# EasyEDA Pro project pcb.epro, schematic Schematic1_2

## Sheets
1 MCU: Board Name: v1.2release; Create Date: 2025-08-14; Page Name: MCU; Project Name: v1.2release; Schematic Name: Schematic1_2; Update Date: 2025-08-14; Add into BOM: yes; Convert to PCB: yes; Drawed: yolo; Page Size: A4; Version: V1.0
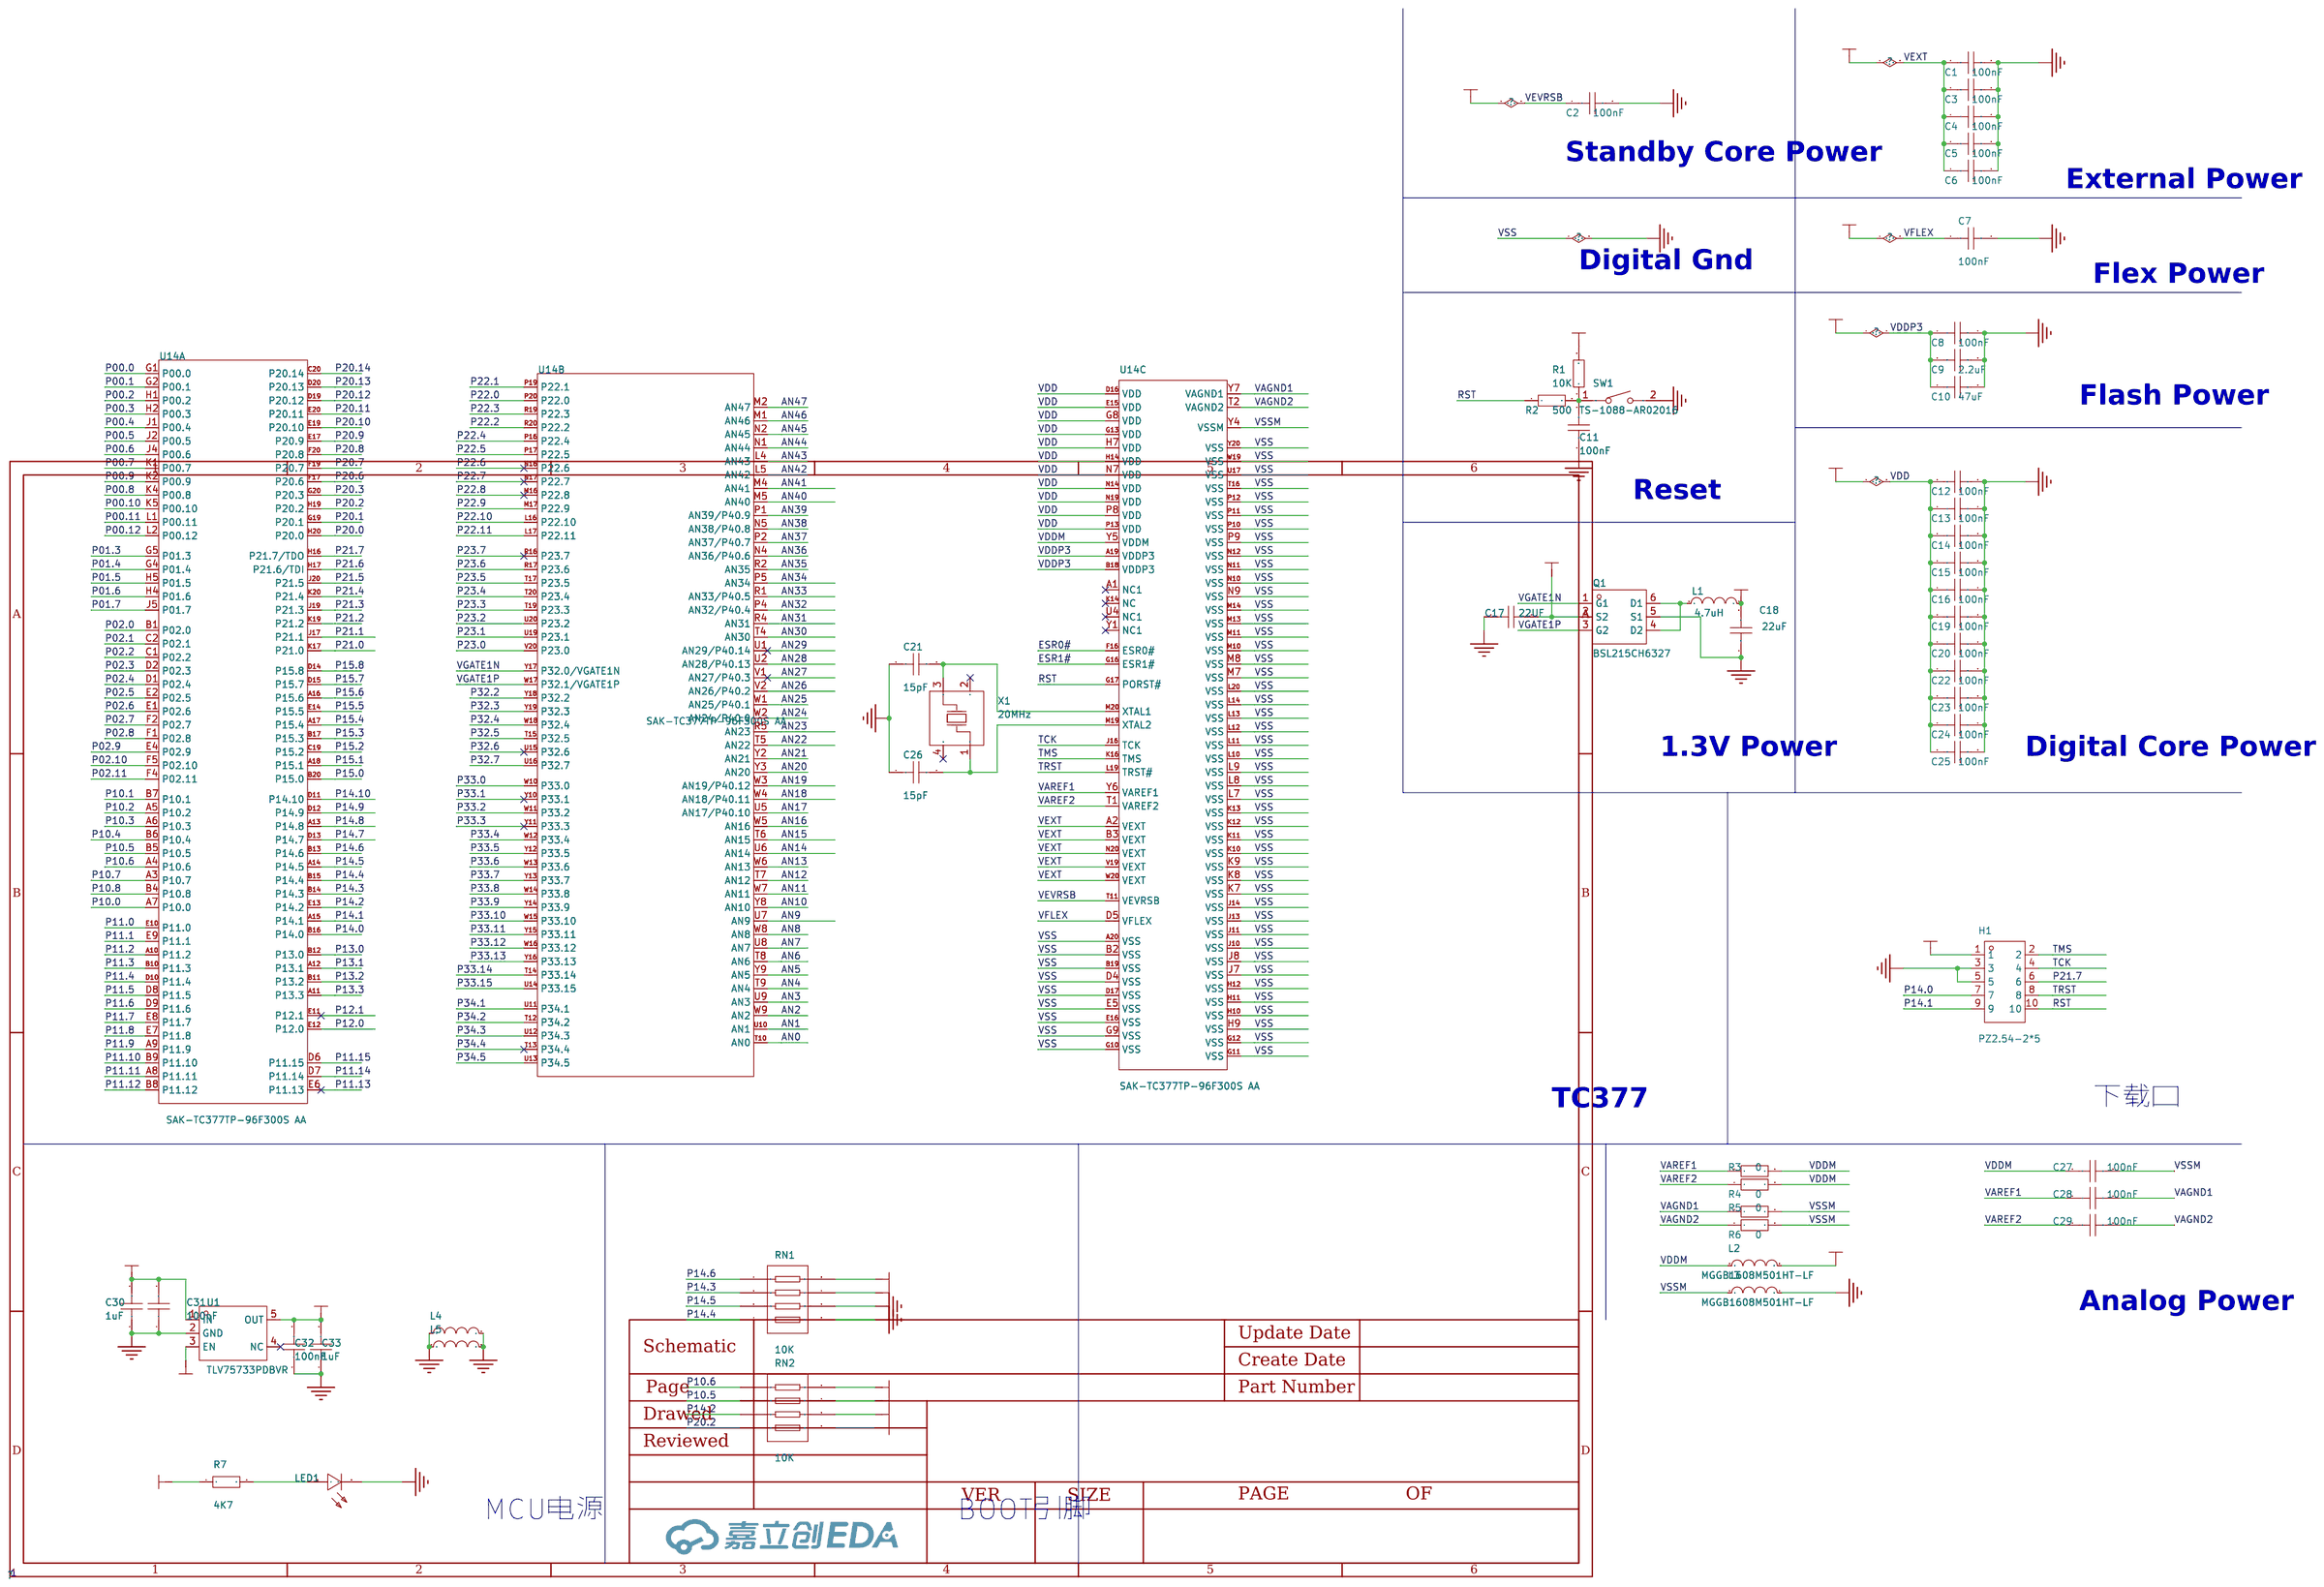
[diagram p0: MCU]
2 电源: Page Name: 电源
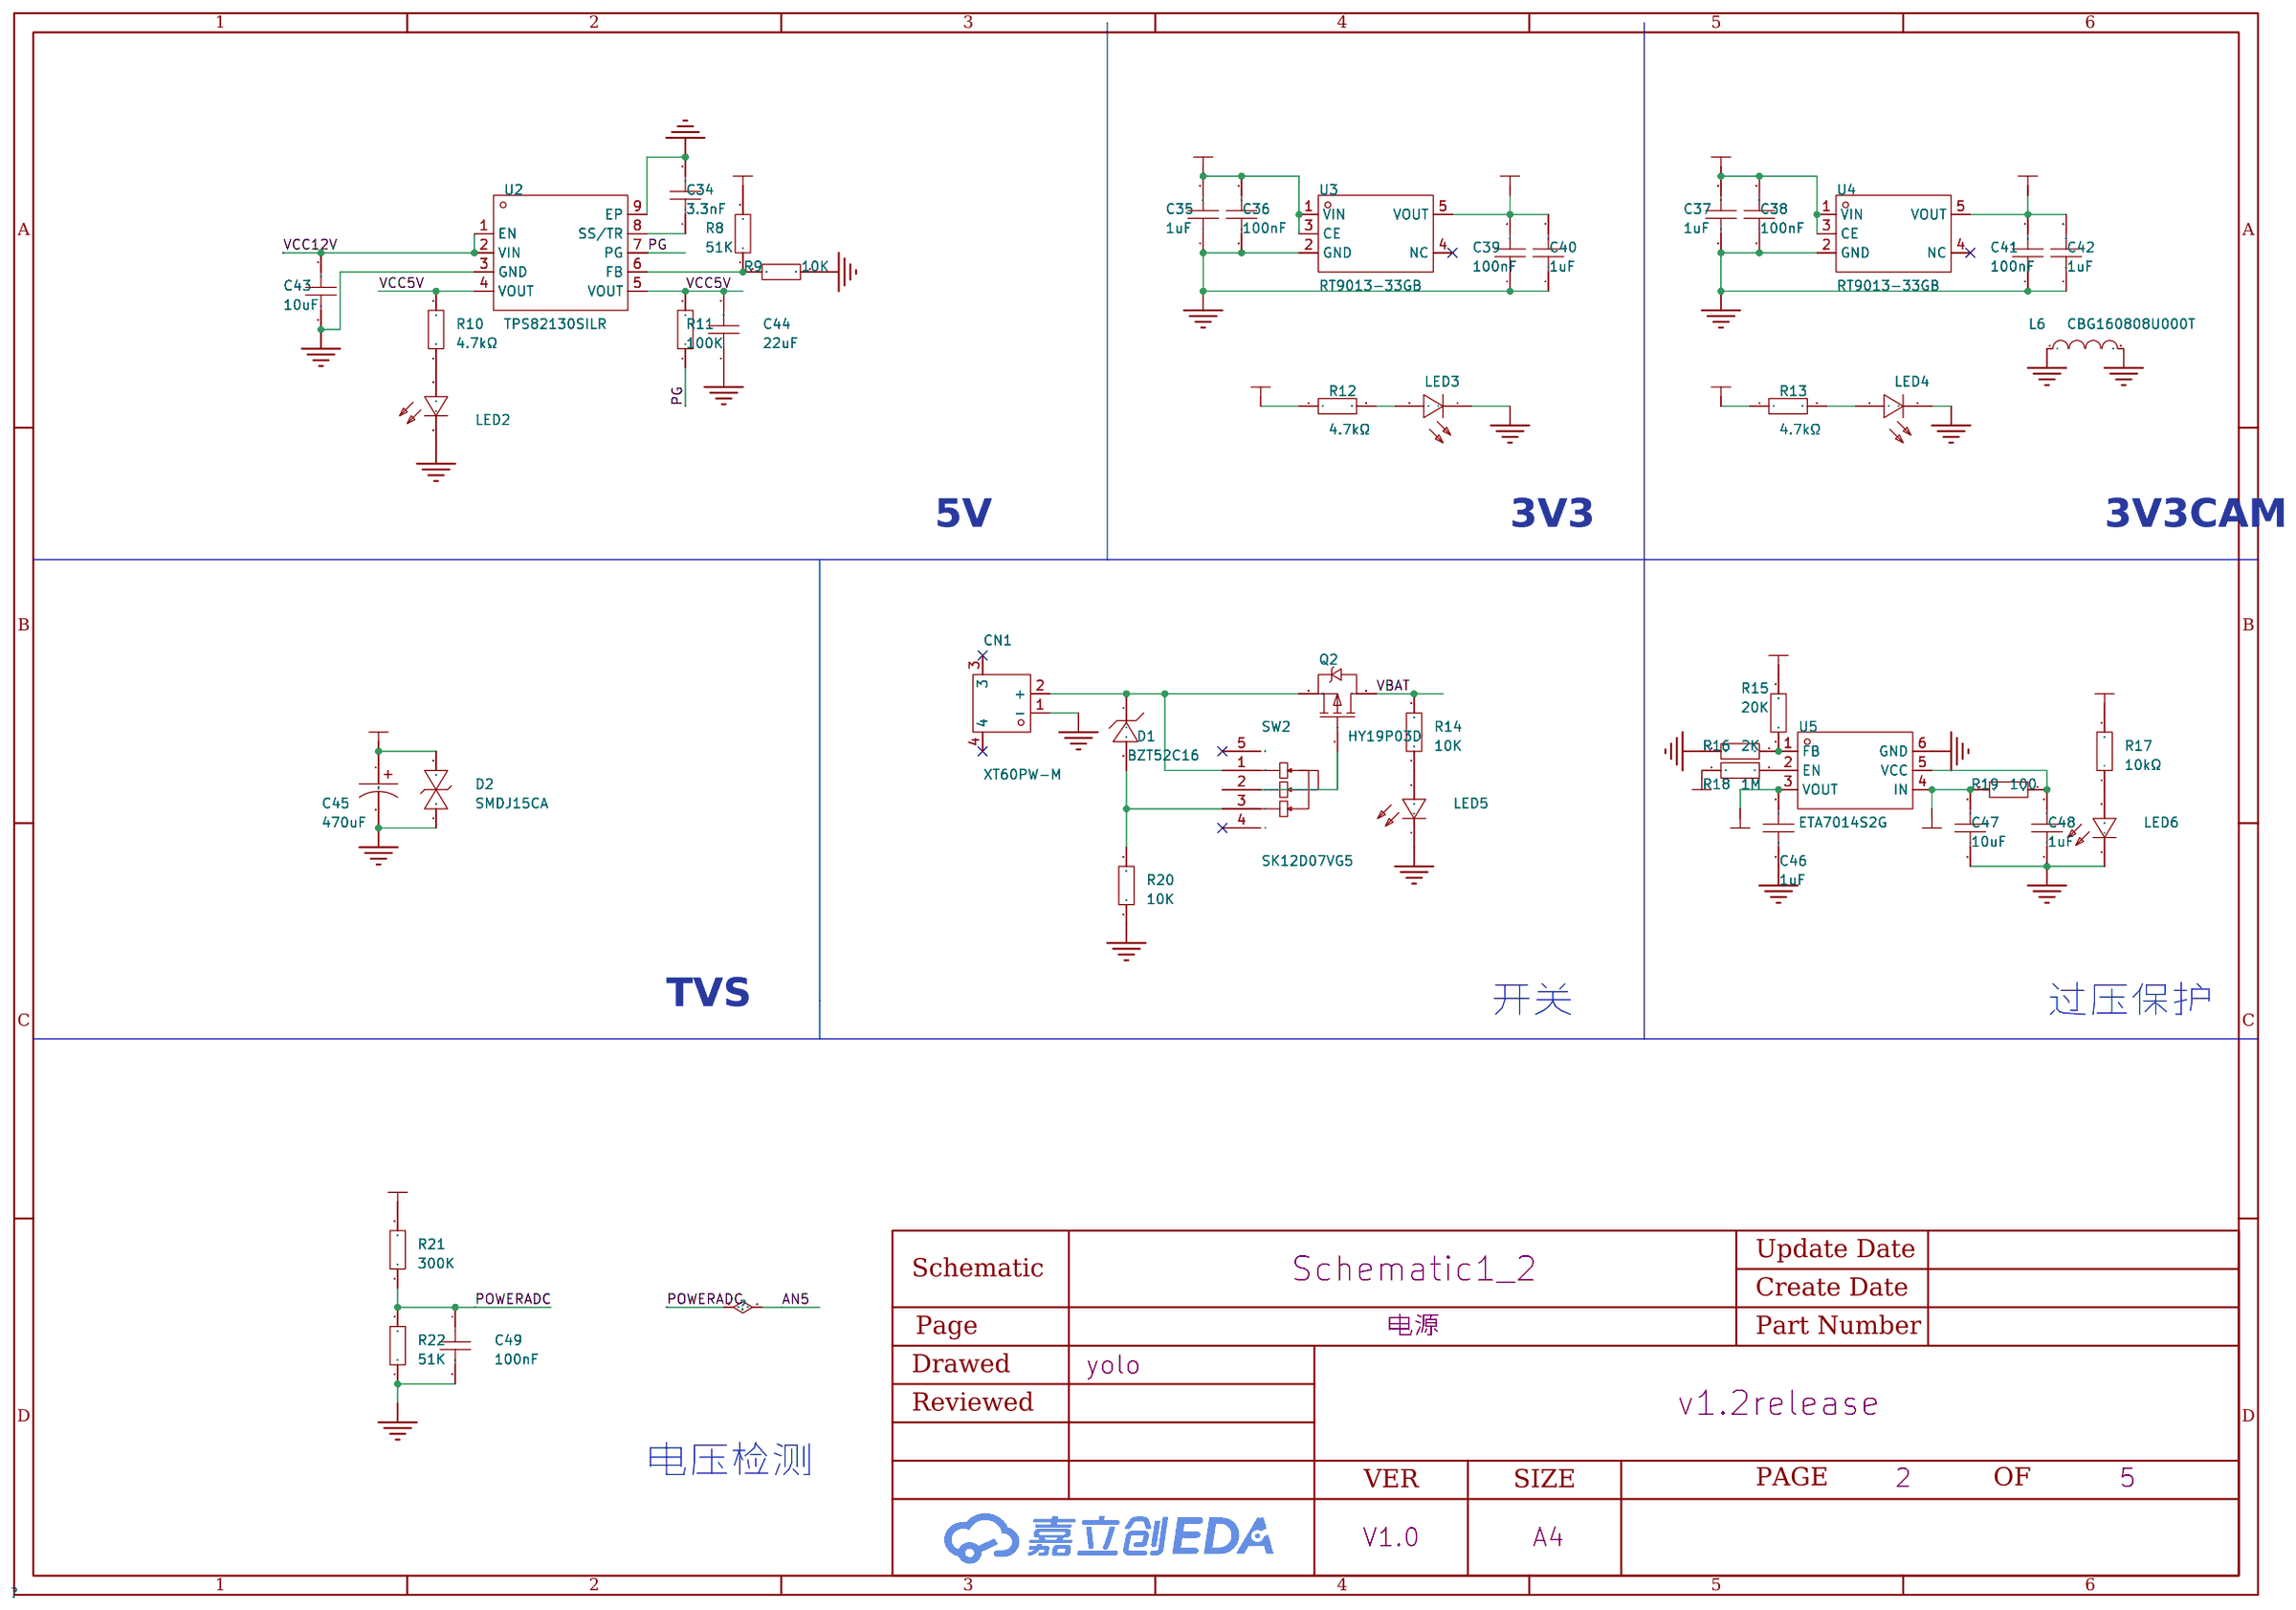
[diagram p1: 电源]
3 外设: Page Name: 外设
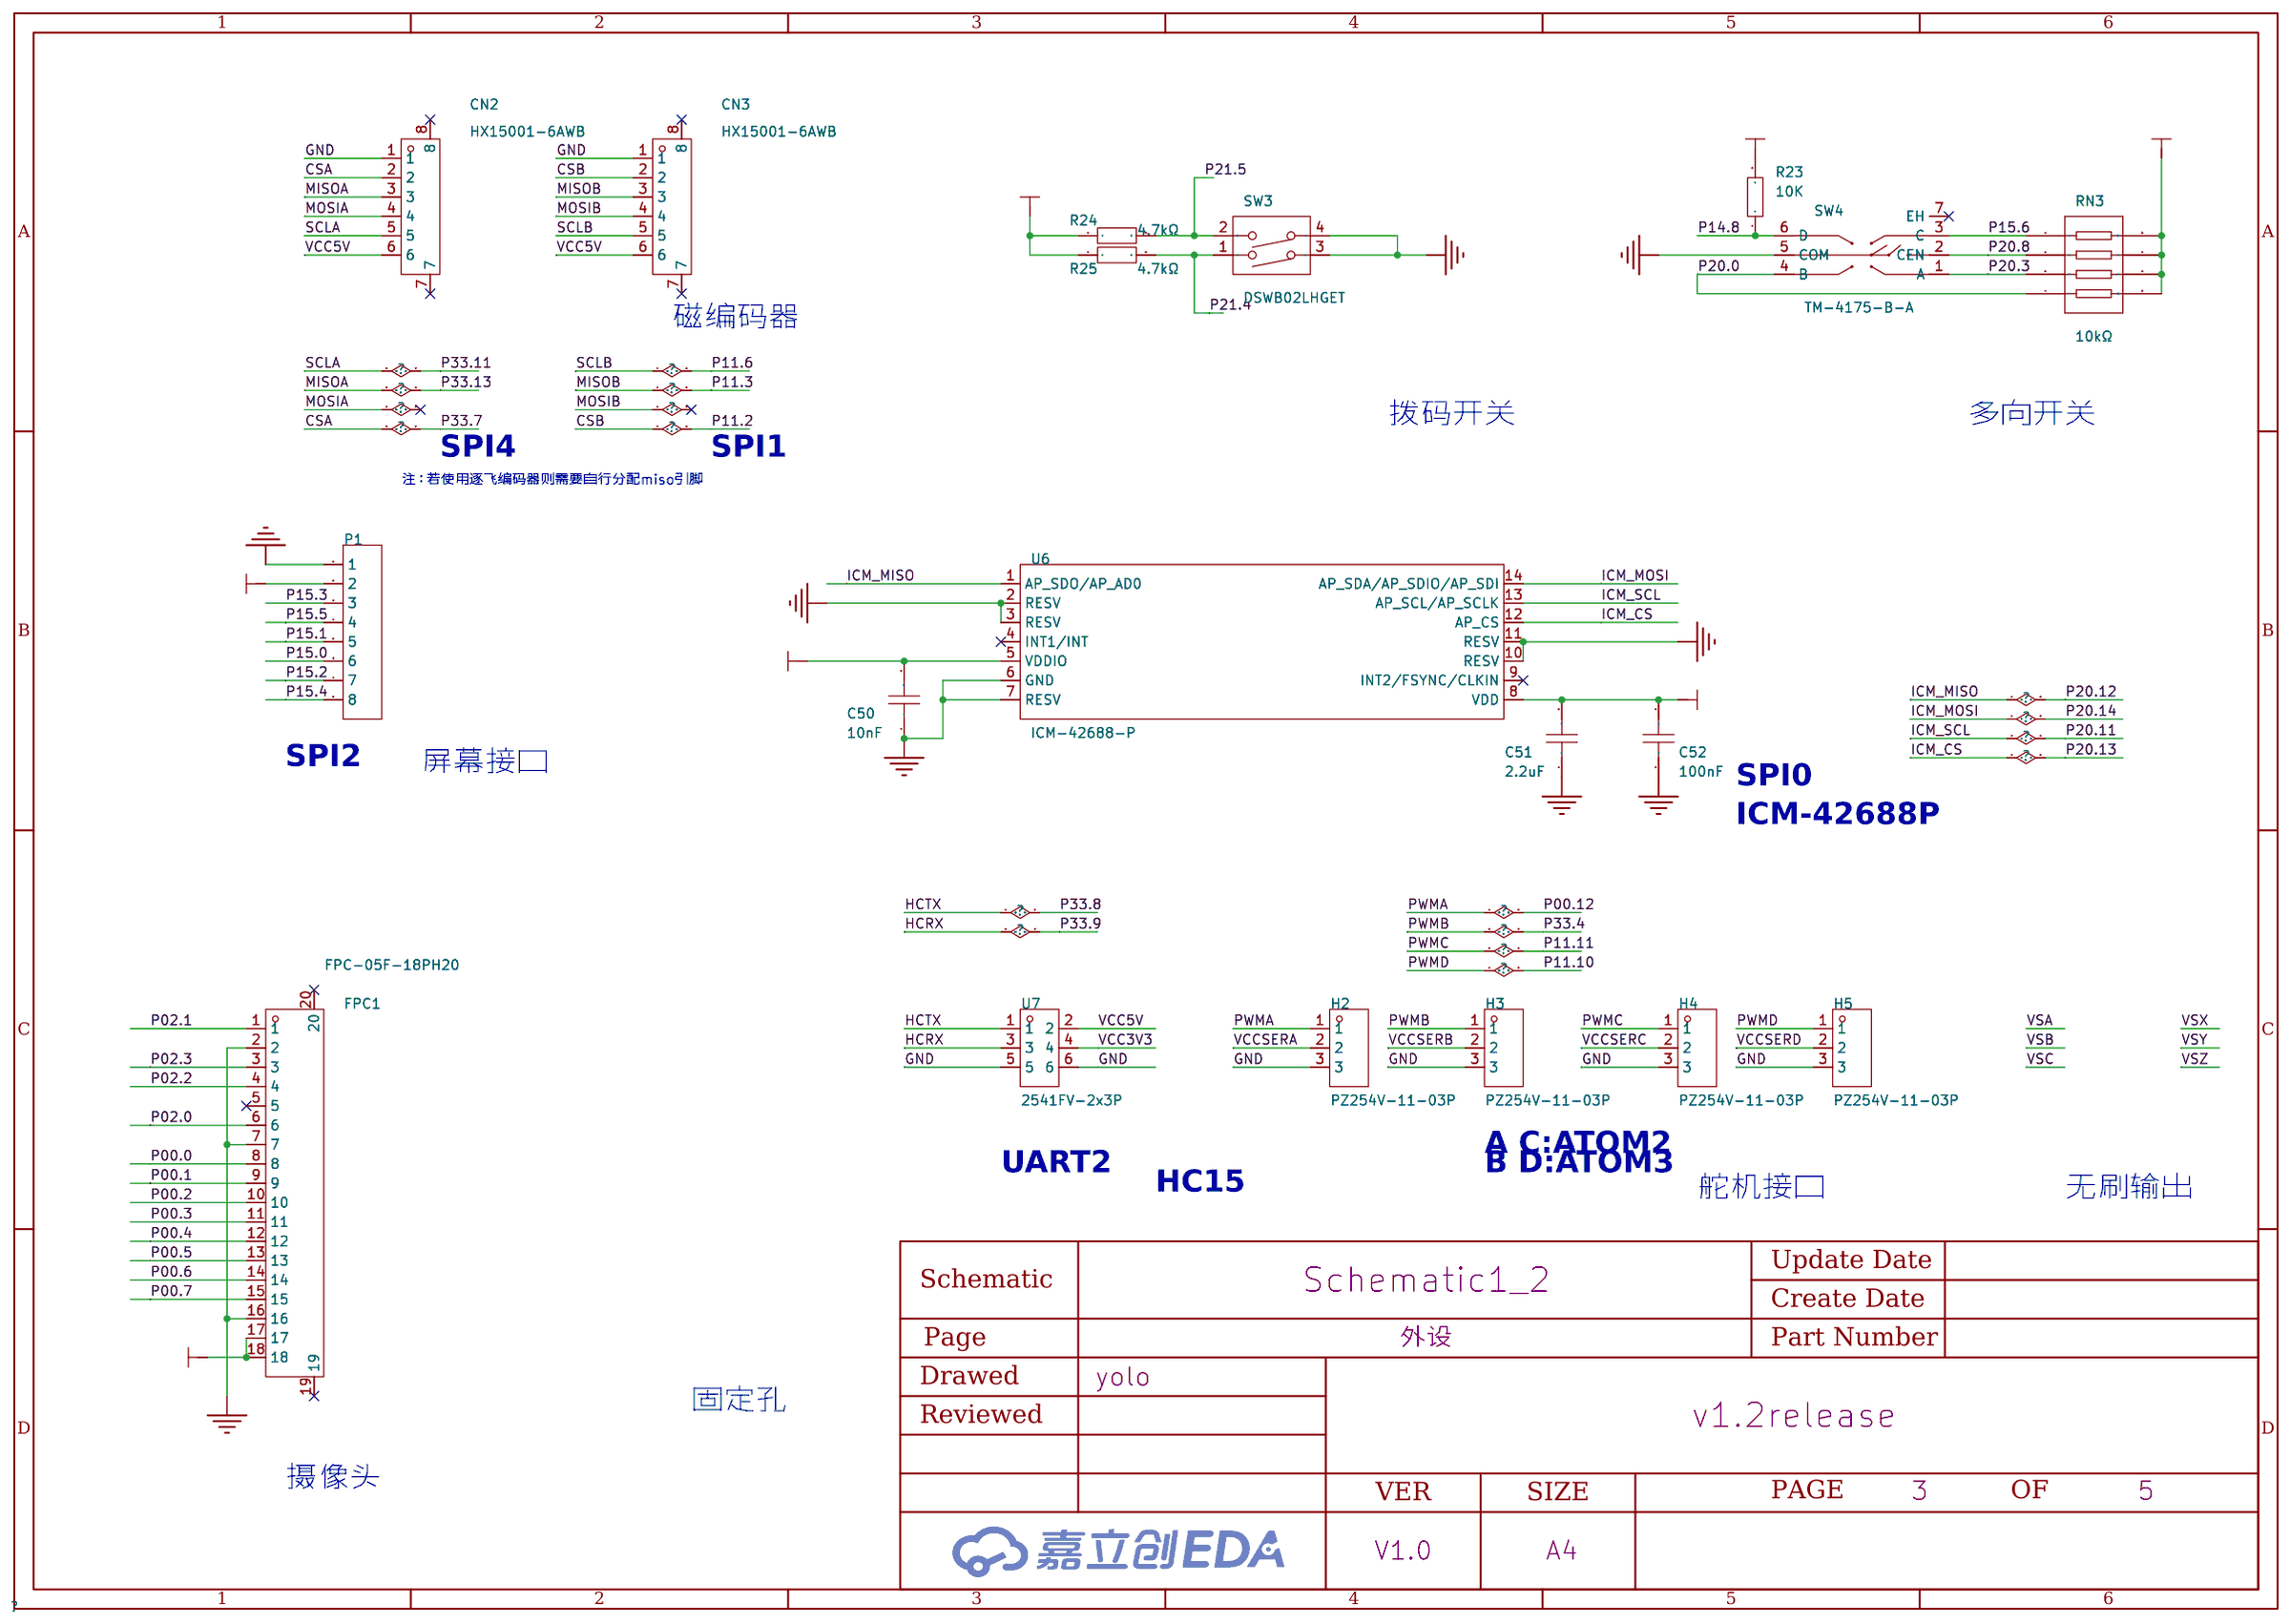
[diagram p2: 外设]
4 驱动: Page Name: 驱动
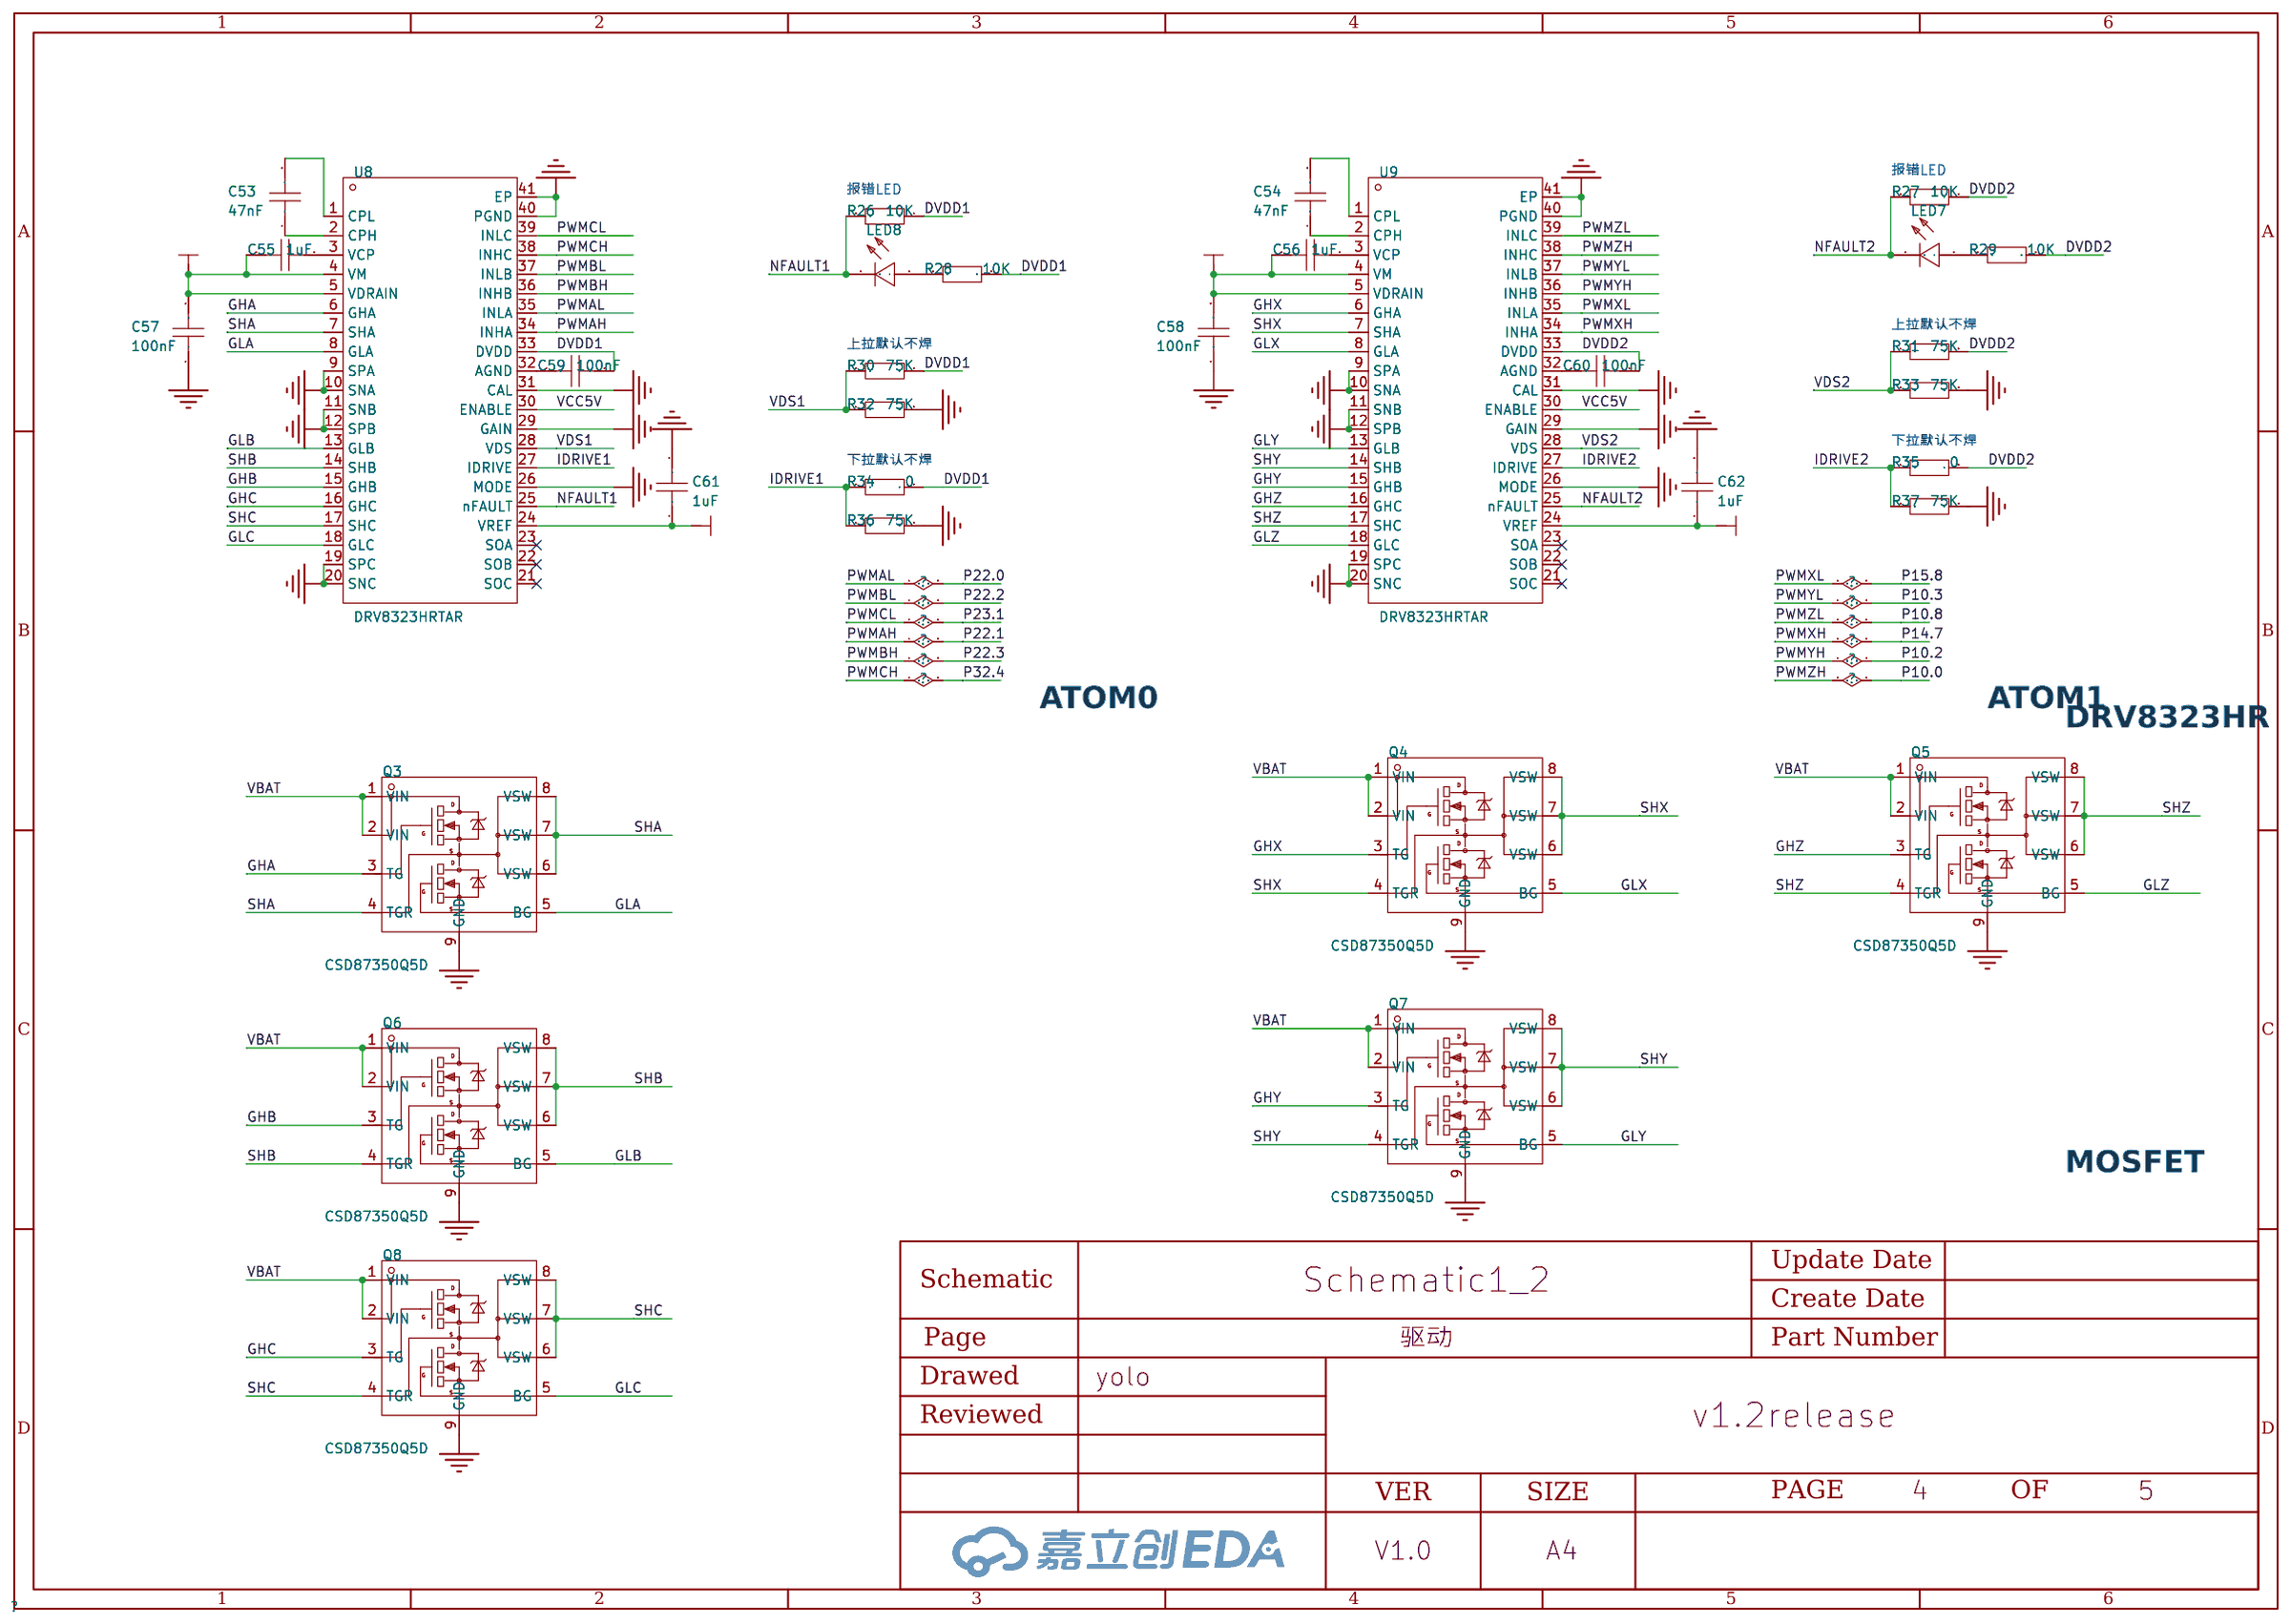
[diagram p3: 驱动]
5 舵机电源: Page Name: 舵机电源
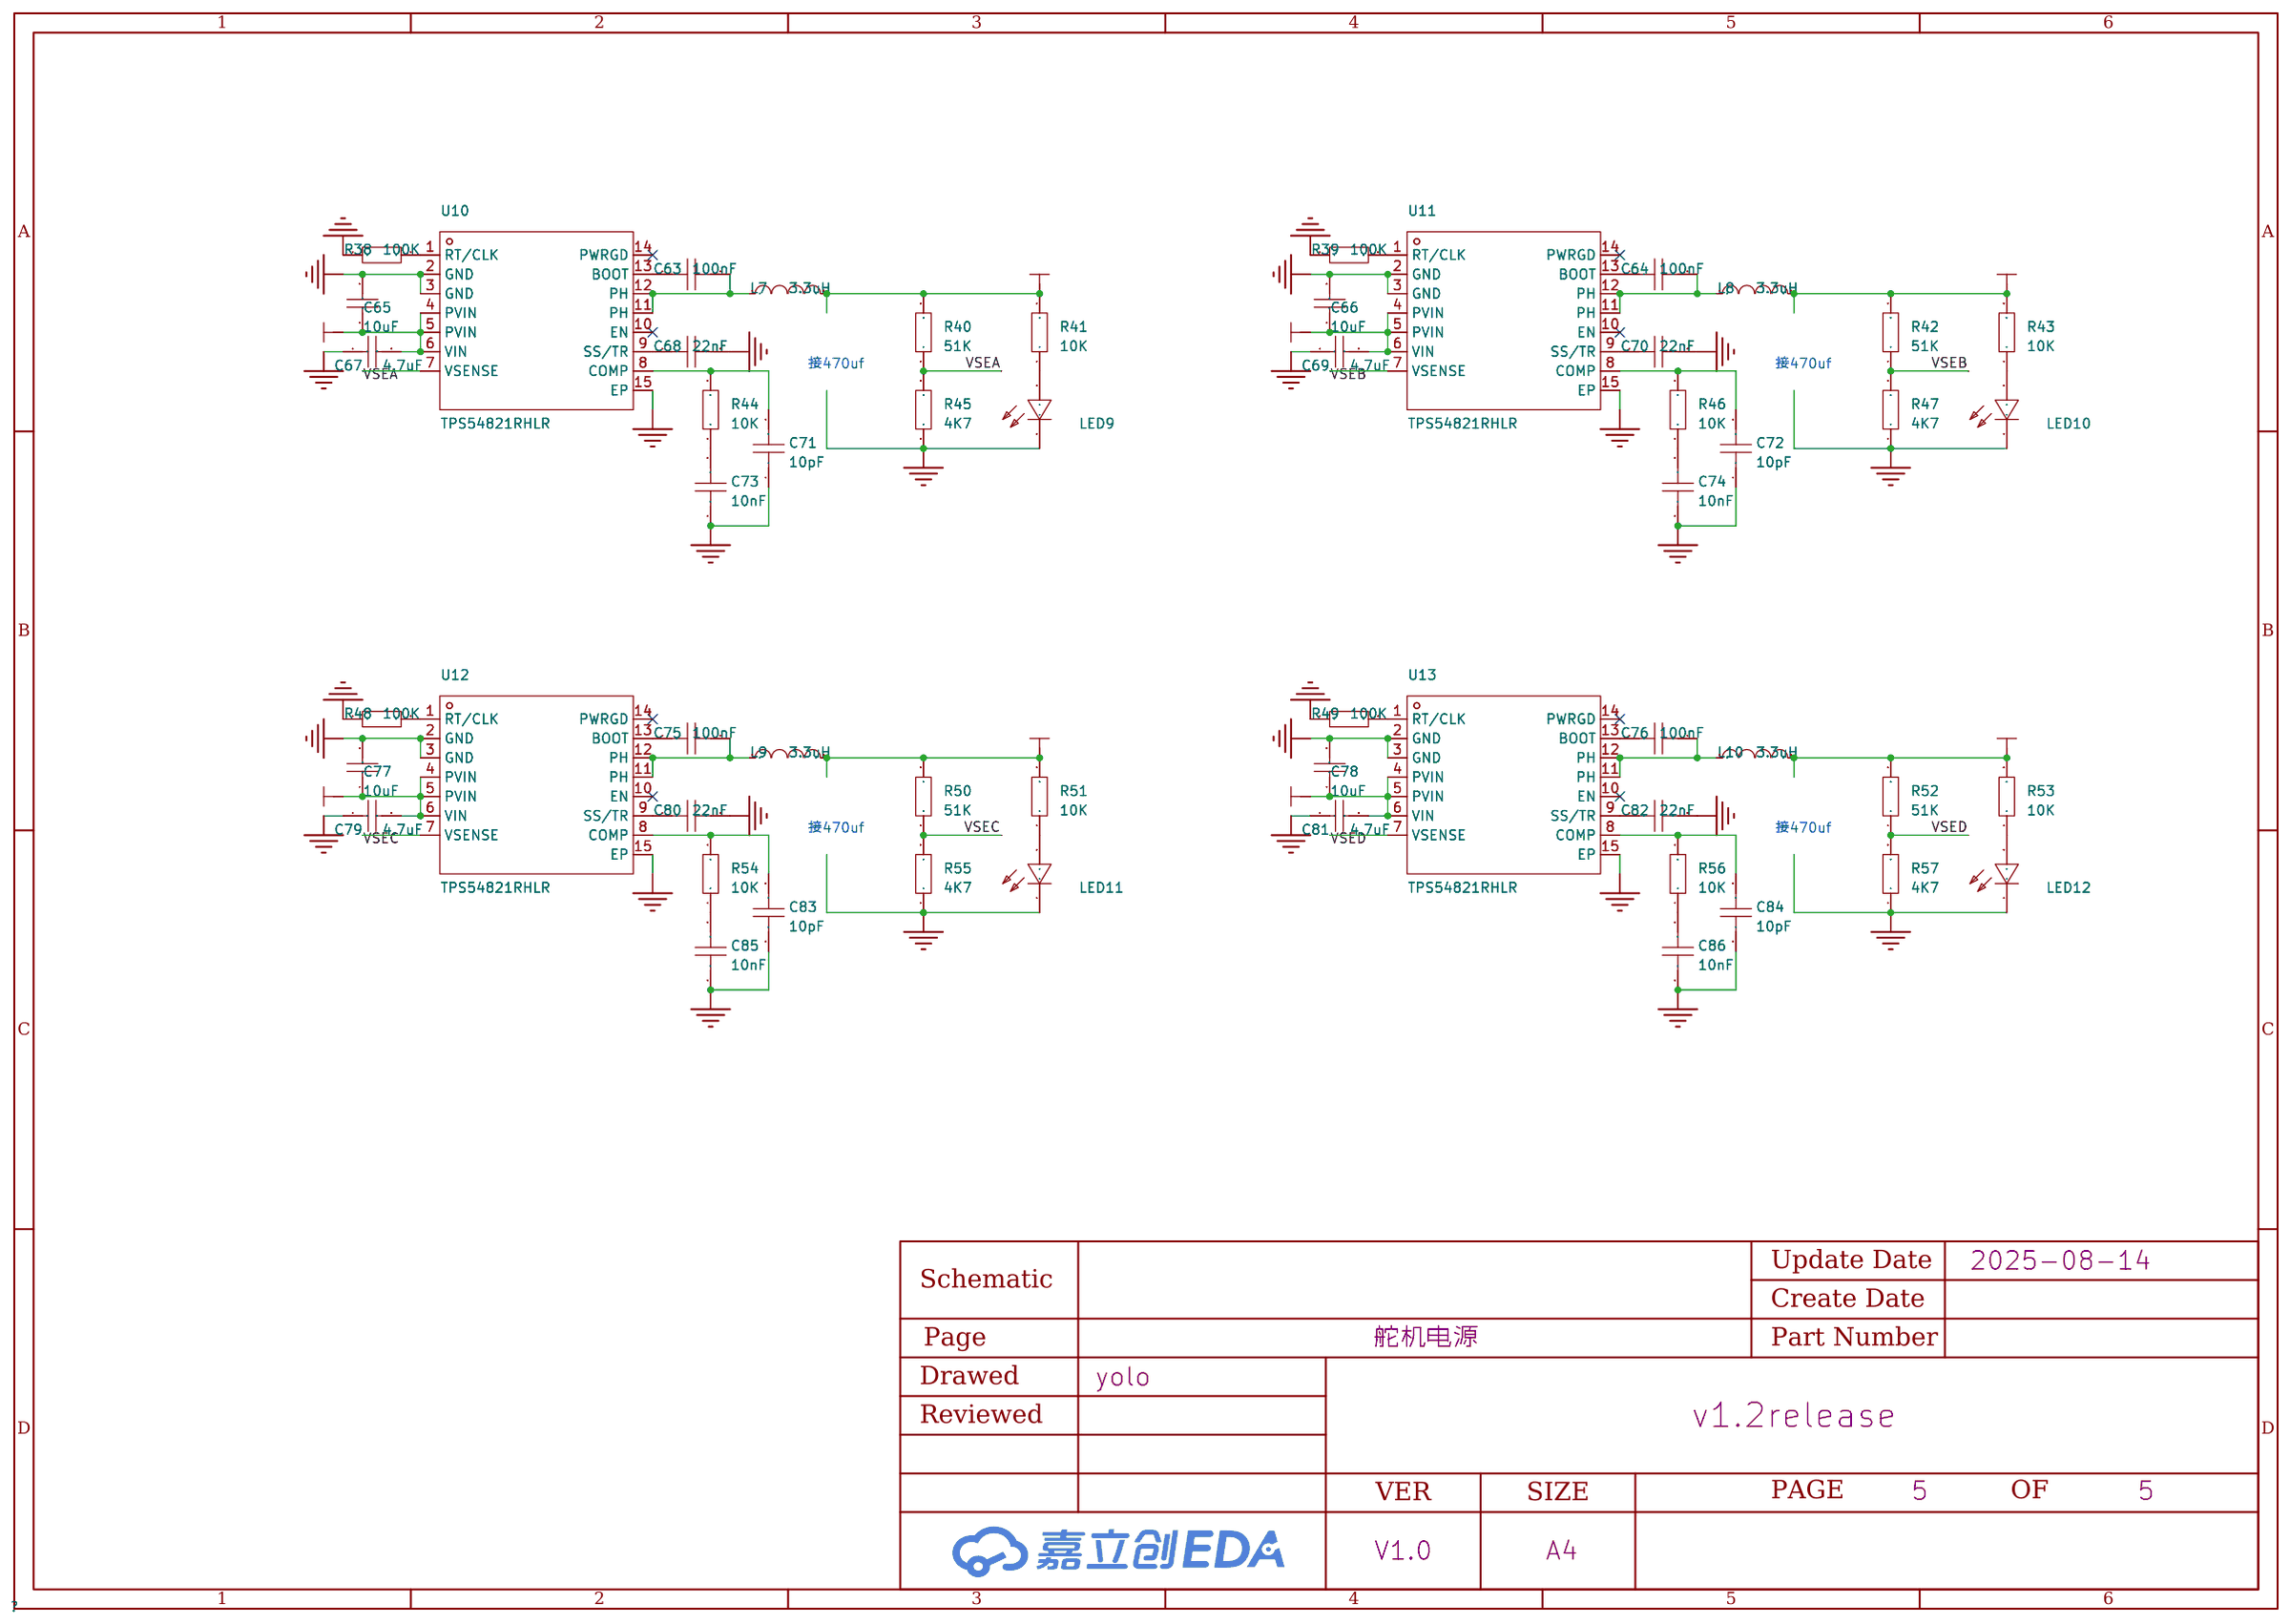
[diagram p4: 舵机电源]

## Parts
sheet MCU
C1  100nF  [C0603]
C2  100nF  [C0603]
C3  100nF  [C0603]
C4  100nF  [C0603]
C5  100nF  [C0603]
C6  100nF  [C0603]
C7  100nF  [C0603]
C8  100nF  [C0603]
C9  2.2uF  [C0603]
C10  47uF  [C0603]
C11  100nF  [C0603]
C12  100nF  [C0603]
C13  100nF  [C0603]
C14  100nF  [C0603]
C15  100nF  [C0603]
C16  100nF  [C0603]
C17  22uF  [C0603]
C18  22uF  [C0603]
C19  100nF  [C0603]
C20  100nF  [C0603]
C21  15pF  [C0603]
C22  100nF  [C0603]
C23  100nF  [C0603]
C24  100nF  [C0603]
C25  100nF  [C0603]
C26  15pF  [C0603]
C27  100nF  [C0603]
C28  100nF  [C0603]
C29  100nF  [C0603]
C30  1uF  [C0603]
C31  100nF  [C0603]
C32  100nF  [C0603]
C33  1uF  [C0603]
H1  PZ2.54-2*5  [HDR-TH_10P-P2.54-V-M-R2-C5-S2.54-1]
L1  4.7uH  [IND-SMD_L2.0-W1.6]
L2  MGGB1608M501HT-LF  [L0603]
L3  MGGB1608M501HT-LF  [L0603]
L4  CBG160808U000T  [L0603]
L5  CBG160808U000T  [L0603]
LED1  NCD0603R1  [LED0603-RD_RED]
Q1  BSL215CH6327  [TSOP-6_L3.0-W1.5-P0.95-LS2.8-BL]
R1  10K  [R0603]
R2  500  [R0603]
R3  0  [R0603]
R4  0  [R0603]
R5  0  [R0603]
R6  0  [R0603]
R7  4K7  [R0603]
RN1  10K  [RES-ARRAY-SMD_0603-8P-L3.2-W1.6-BL]
RN2  10K  [RES-ARRAY-SMD_0603-8P-L3.2-W1.6-BL]
SW1  TS-1088-AR02016  [SW-SMD_L3.9-W3.0-P4.45]
U1  TLV75733PDBVR  [SOT-23-5_L2.9-W1.6-P0.95-LS2.8-BL]
U14  SAK-TC377TP-96F300S AA  [PG-LFBGA-292_L17.0-W17.0-BL_SAK-TC1791F]  (sections 1,2,3)
X1  20MHz  [OSC-SMD_4P-L3.2-W2.5-BL]
sheet 外设
C50  10nF  [C0603]
C51  2.2uF  [C0603]
C52  100nF  [C0603]
CN2  HX15001-6AWB  [CONN-SMD_HX15001-6AWB]
CN3  HX15001-6AWB  [CONN-SMD_HX15001-6AWB]
FPC1  FPC-05F-18PH20  [FPC-SMD_18P-P0.50_FPC-05F-18PH20]
H2  PZ254V-11-03P  [HDR-TH_3P-P2.54-V-M]
H3  PZ254V-11-03P  [HDR-TH_3P-P2.54-V-M]
H4  PZ254V-11-03P  [HDR-TH_3P-P2.54-V-M]
H5  PZ254V-11-03P  [HDR-TH_3P-P2.54-V-M]
P1  2.54-1*8P母环保  [HDR-TH_8P-P2.54-V-F-1]
R23  10K  [R0603]
R24  4.7kΩ  [R0603]
R25  4.7kΩ  [R0603]
RN3  10kΩ  [RES-ARRAY-SMD_0603-8P-L3.2-W1.6-BL]
SW3  DSWB02LHGET  [SW-TH_DSWB02LHGET]
SW4  TM-4175-B-A  [SW-SMD_TM-4175-B-X]
U6  ICM-42688-P  [LGA-14_L3.0-W2.5-P0.50-TL]
U7  2541FV-2x3P  [HDR-TH_6P-P2.54-V-F-R2-C3-S2.54]
sheet 电源
C34  3.3nF  [C0603]
C35  1uF  [C0603]
C36  100nF  [C0603]
C37  1uF  [C0603]
C38  100nF  [C0603]
C39  100nF  [C0603]
C40  1uF  [C0603]
C41  100nF  [C0603]
C42  1uF  [C0603]
C43  10uF  [C0603]
C44  22uF  [C0603]
C45  470uF  [CAP-SMD_BD10.0-L10.3-W10.3-LS11.3-FD]
C46  1uF  [C0603]
C47  10uF  [C0603]
C48  1uF  [C0603]
C49  100nF  [C0603]
CN1  XT60PW-M  [CONN-TH_XT60PW-M]
D1  BZT52C16  [SOD-123_L2.7-W1.6-LS3.7-RD]
D2  SMDJ15CA  [SMC_L6.9-W5.9-LS7.9-BI]
L6  CBG160808U000T  [L0603]
LED2  NCD0603R1  [LED0603-RD_RED]
LED3  NCD0603R1  [LED0603-RD_RED]
LED4  NCD0603R1  [LED0603-RD_RED]
LED5  NCD0603R1  [LED0603-RD_RED]
LED6  NCD0603R1  [LED0603-RD_RED]
Q2  HY19P03D  [TO-252-2_L6.6-W6.1-P4.57-LS9.9-TL-CW]
R8  51K  [R0603]
R9  10K  [R0603]
R10  4.7kΩ  [R0603]
R11  100K  [R0603]
R12  4.7kΩ  [R0603]
R13  4.7kΩ  [R0603]
R14  10K  [R0603]
R15  20K  [R0603]
R16  2K  [R0603]
R17  10kΩ  [R0603]
R18  1M  [R0603]
R19  100  [R0603]
R20  10K  [R0603]
R21  300K  [R0603]
R22  51K  [R0603]
SW2  SK12D07VG5  [SW-TH_SK12D07VG5]
U2  TPS82130SILR  [USIP-8_L3.0-W2.8-P0.65-TL-EP]
U3  RT9013-33GB  [SOT-23-5_L2.9-W1.6-P0.95-LS2.8-BR]
U4  RT9013-33GB  [SOT-23-5_L2.9-W1.6-P0.95-LS2.8-BR]
U5  ETA7014S2G  [SOT-23-6_L2.9-W1.6-P0.95-LS2.8-BL]
sheet 舵机电源
C63  100nF  [C0603]
C64  100nF  [C0603]
C65  10uF  [C0805]
C66  10uF  [C0805]
C67  4.7uF  [C0805]
C68  22nF  [C0603]
C69  4.7uF  [C0805]
C70  22nF  [C0603]
C71  10pF  [C0603]
C72  10pF  [C0603]
C73  10nF  [C0603]
C74  10nF  [C0603]
C75  100nF  [C0603]
C76  100nF  [C0603]
C77  10uF  [C0805]
C78  10uF  [C0805]
C79  4.7uF  [C0805]
C80  22nF  [C0603]
C81  4.7uF  [C0805]
C82  22nF  [C0603]
C83  10pF  [C0603]
C84  10pF  [C0603]
C85  10nF  [C0603]
C86  10nF  [C0603]
L7  3.3uH  [IND-SMD_L7.1-W6.6]
L8  3.3uH  [IND-SMD_L7.1-W6.6]
L9  3.3uH  [IND-SMD_L7.1-W6.6]
L10  3.3uH  [IND-SMD_L7.1-W6.6]
LED9  NCD0603R1  [LED0603-RD_RED]
LED10  NCD0603R1  [LED0603-RD_RED]
LED11  NCD0603R1  [LED0603-RD_RED]
LED12  NCD0603R1  [LED0603-RD_RED]
R38  100K  [R0603]
R39  100K  [R0603]
R40  51K  [R0603]
R41  10K  [R0603]
R42  51K  [R0603]
R43  10K  [R0603]
R44  10K  [R0603]
R45  4K7  [R0603]
R46  10K  [R0603]
R47  4K7  [R0603]
R48  100K  [R0603]
R49  100K  [R0603]
R50  51K  [R0603]
R51  10K  [R0603]
R52  51K  [R0603]
R53  10K  [R0603]
R54  10K  [R0603]
R55  4K7  [R0603]
R56  10K  [R0603]
R57  4K7  [R0603]
U10  TPS54821RHLR  [VQFN-14_L3.5-W3.5-P0.50-TL-EP_TPS54622RHLT]
U11  TPS54821RHLR  [VQFN-14_L3.5-W3.5-P0.50-TL-EP_TPS54622RHLT]
U12  TPS54821RHLR  [VQFN-14_L3.5-W3.5-P0.50-TL-EP_TPS54622RHLT]
U13  TPS54821RHLR  [VQFN-14_L3.5-W3.5-P0.50-TL-EP_TPS54622RHLT]
sheet 驱动
C53  47nF  [C0603]
C54  47nF  [C0603]
C55  1uF  [C0603]
C56  1uF  [C0603]
C57  100nF  [C0603]
C58  100nF  [C0603]
C59  100nF  [C0603]
C60  100nF  [C0603]
C61  1uF  [C0603]
C62  1uF  [C0603]
LED7  NCD0603R1  [LED0603-RD_RED]
LED8  NCD0603R1  [LED0603-RD_RED]
Q3  CSD87350Q5D  [LSON-8_L6.0-W5.0-P1.27-LS6.0-TL-EP]
Q4  CSD87350Q5D  [LSON-8_L6.0-W5.0-P1.27-LS6.0-TL-EP]
Q5  CSD87350Q5D  [LSON-8_L6.0-W5.0-P1.27-LS6.0-TL-EP]
Q6  CSD87350Q5D  [LSON-8_L6.0-W5.0-P1.27-LS6.0-TL-EP]
Q7  CSD87350Q5D  [LSON-8_L6.0-W5.0-P1.27-LS6.0-TL-EP]
Q8  CSD87350Q5D  [LSON-8_L6.0-W5.0-P1.27-LS6.0-TL-EP]
R26  10K  [R0603]
R27  10K  [R0603]
R28  10K  [R0603]
R29  10K  [R0603]
R30  75K  [R0603]
R31  75K  [R0603]
R32  75K  [R0603]
R33  75K  [R0603]
R34  0  [R0603]
R35  0  [R0603]
R36  75K  [R0603]
R37  75K  [R0603]
U8  DRV8323HRTAR  [QFN-40_L6.0-W6.0-P0.50-BL-EP4.5]
U9  DRV8323HRTAR  [QFN-40_L6.0-W6.0-P0.50-BL-EP4.5]

## Library data of the parts
C1-C16 C19-C26 C31 C32 C34-C44 C46-C64 C68 C70-C76 C80 C82-C86 = CAP_0603: Supplier Footprint: 0603
C17 C18 = CAP_0603: 容值:100nF;精度:±10%;额定电压:50V;温度系数:X7R;; Supplier Footprint: 0603
C27-C29 = CC0603KRX7R9BB104: 容值:100nF;精度:±10%;额定电压:50V;材质(温度系数):X7R;; LCSC Part Name: 100nF ±10% 50V; Supplier Part: C14663; Manufacturer: YAGEO(国巨); Supplier Footprint: 0603; JLCPCB Part Class: 基础库; Datasheet: https://atta.szlcsc.com/upload/public/pdf/source/20180910/C282072_33301C7F631E79921B82A8DAC6BCC5B3.pdf; Supplier: LCSC; Tolerance: ±10%; Voltage Rated: 50V; Temperature Coefficient: X7R
C30 C33 = CL10A105KB8NNNC: 容值:1uF;精度:±10%;额定电压:50V;材质(温度系数):X5R;; LCSC Part Name: 1uF ±10% 50V; Supplier Part: C15849; Manufacturer: SAMSUNG(三星); Supplier Footprint: 0603; JLCPCB Part Class: 基础库; Datasheet: https://atta.szlcsc.com/upload/public/pdf/source/20160218/1457707763339.pdf; Supplier: LCSC; Tolerance: ±10%; Voltage Rated: 50V; Temperature Coefficient: X5R
H1 = PZ2.54-2*5: 插针结构:2x5P;间距:2.54mm;排数:双排;总PIN位数:10P;; Supplier Part: C5156677; Manufacturer: ZHOURI(洲日); Supplier Footprint: 插件,P=2.54mm; JLCPCB Part Class: 扩展库; Datasheet: https://atta.szlcsc.com/upload/public/pdf/source/20220923/FF9D303E4B04AC19FF78D5B876650950.pdf; Supplier: LCSC; Pin Structure: 2x5P; Pitch: 2.54mm; Number of Rows: 双排; Number of Pins: 10P
L1 = SLO201610F1R5MTT: 电感值:1.5uH;精度:±20%;额定电流:1.79A;直流电阻(DCR):113mΩ;; LCSC Part Name: 1.5uH±20%1.79A113mΩ; Supplier Part: C275659; Manufacturer: Sunltech(韩国顺磁); Supplier Footprint: SMD; JLCPCB Part Class: ExtendedPart; Datasheet: https://atta.szlcsc.com/upload/public/pdf/source/20181022/C275659_0BCB8C1B3811A29B39EE579B59B817FF.pdf; Supplier: LCSC; Tolerance: ±20%; Rated Current: 1.79A; DC Resistance (DCR): 113mΩ
L2 L3 = MGGB1608M501HT-LF: 标称阻抗@测试频率:500Ω@100MHz;误差:±25%;直流电阻(RDC):-;; LCSC Part Name: 单路 0603磁珠 阻抗500Ω@100MHz; Supplier Part: C281149; Manufacturer: microgate(麦捷科技); Supplier Footprint: 0603; JLCPCB Part Class: 扩展库; Datasheet: https://atta.szlcsc.com/upload/public/pdf/source/20200220/C486339_8AC995628986C74D95A8947231DBAF68.pdf; Supplier: LCSC; Impedance @ Frequency: 500Ω@100MHz; Tolerance: ±25%; Circuits: 1
L4-L6 = CBG160808U000T: 标称阻抗@测试频率:0Ω@100MHz;直流电阻(RDC):100mΩ;; LCSC Part Name: 单路 0603磁珠 阻抗0Ω@100MHz; Supplier Part: C43163; Manufacturer: FH(风华); Supplier Footprint: 0603; JLCPCB Part Class: 扩展库; Datasheet: https://atta.szlcsc.com/upload/public/pdf/source/20190129/C361667_1614D407CC98D1D3CFBD9E1F7511C14D.pdf; Supplier: LCSC; Impedance @ Frequency: 0Ω@100MHz; DC Resistance: 100mΩ; Current Rating: 800mA; Circuits: 1
LED1-LED12 = NCD0603R1_C84263: 灯头类型:-;发光颜色:红色;正向电压(VF):1.6V~2.6V;功率:65mW;正向电流:20mA;主波长:615nm~630nm;二极管配置:独立二极管;透镜颜色:无色透明透镜;色温:-;发光强度:80mcd~220mcd;发光角度:130°;载带方式:-;工作温度:-30℃~+85℃;; Supplier Part: C84263; Manufacturer: 国星光电; Supplier Footprint: 0603; JLCPCB Part Class: Extended Part; Datasheet: https://atta.szlcsc.com/upload/public/pdf/source/20200820/C84263_DABC6A75E58F576973B407FDBA283D60.pdf; Supplier: LCSC; Emitted Color: 红色; Forward Voltage (VF): 1.6V~2.6V; Power Dissipation: 65mW; Forward Current: 20mA; Dominant Wavelength: 615nm~630nm; Diode Configuration: 独立二极管; Lens Color: 无色透明透镜; Luminous Intensity: 80mcd~220mcd; Viewing Angle: 130°; Operating Temperature: -30℃~+85℃
Q1 = BSL215CH6327: 类型:1个N沟道和1个P沟道;漏源电压(Vdss):20V;连续漏极电流(Id):1.5A;功率(Pd):500mW;导通电阻(RDS(on)@Vgs,Id):140mΩ@4.5V,1.5A;阈值电压(Vgs(th)@Id):1.2V@3.7A;; LCSC Part Name: 1个N沟道和1个P沟道20V1.5A; Supplier Part: C150914; Manufacturer: Infineon(英飞凌); Supplier Footprint: TSOP-6; JLCPCB Part Class: ExtendedPart; Datasheet: https://atta.szlcsc.com/upload/public/pdf/source/20180125/C150914_15168616334001301814.pdf; Supplier: LCSC; Type: 1个N沟道和1个P沟道; Drain Source Voltage (Vdss): 20V; Continuous Drain Current (Id): 1.5A; Power Dissipation (Pd): 500mW; Drain Source On Resistance (RDS(on)@Vgs,Id): 140mΩ@4.5V,1.5A; Gate Threshold Voltage (Vgs(th)@Id): 1.2V@3.7A
R1-R9 R11 R15 R16 R18-R20 R26-R57 = Res_0603: Supplier Footprint: 0603
RN1-RN3 = 4D03WGJ0103T5E: 电阻器数:4;阻值:10kΩ;精度:±5%;单个元件功率:62.5mW;温度系数:±200ppm/℃;; LCSC Part Name: 10kΩ ±5%; Supplier Part: C29718; Manufacturer: UNI-ROYAL(厚声); Supplier Footprint: 0603x4; JLCPCB Part Class: 基础库; Datasheet: https://atta.szlcsc.com/upload/public/pdf/source/20191224/C474318_2527498AE30E813171187CCD28401A71.pdf; Supplier: LCSC; Number of Resistors: 4; Tolerance: ±5%; Power(Watts): 62.5mW; Temperature Coefficient: ±200ppm/℃; Number of Pins: 8
SW1 = TS-1088-AR02016: 电路结构:单刀单掷;带支架:否;触点电流:50mA;额定电压(DC):12V;安装方式:立贴;绝缘电阻:100MΩ;作用力:160gf@±50gf;机械寿命:10万次;; LCSC Part Name: 4*3*2mm 立贴 轻触开关; Supplier Part: C720477; Manufacturer: XUNPU(讯普); Supplier Footprint: SMD; JLCPCB Part Class: 扩展库; Datasheet: https://atta.szlcsc.com/upload/public/pdf/source/20200810/C720475_60D09DD6C54279ADDB2DC25100F1CC11.pdf; Supplier: LCSC; Circuit: 单刀单掷; Actuator Style: 圆形按钮; Switch Length: 4mm; Switch Width: 3mm; Switch Height: 2mm; Strike Gundam: 否; Contact Current: 50mA; Voltage Rating (DC): 12V; Mounting Style: 立贴; Insulation Resistance: 100MΩ; Actuator/Cap Color: 黑色; Operating Force: 160gf@±50gf; Pin Style: SMD接片; Mechanical Life: 10万次; Operating Temperature: -30℃~+80℃
U1 = TLV75733PDBVR: 输出类型:固定;最大输入电压:5.5V;输出电压:3.3V;输出电流:1A;电源纹波抑制比(PSRR):52dB;输出极性:正极;; LCSC Part Name: 具有使能功能的 1A、低 IQ、高精度、低压降稳压器; Supplier Part: C485517; Manufacturer: TI(德州仪器); Supplier Footprint: SOT-23-5; JLCPCB Part Class: 扩展库; Datasheet: https://www.ti.com/cn/lit/gpn/tlv757p; Supplier: LCSC; Output Type: 固定; Maximum Input Voltage: 5.5V; Output Voltage: 3.3V; Output Current: 1A; Power Supply Rejection Ratio (PSRR): 52dB; Dropout Voltage: 475mV@(1A); Feature: 防静电保护；浪涌保护；低ESR；热保护(TSD)；欠压闭锁；过流保护(OCP)；带使能; Operating Temperature: -40℃~+125℃@(Tj); Output Polarity: 正极; Number of Outputs: 1
U14 = SAK-TC377TP-96F300S AA: Supplier Part: C538866; Manufacturer: Infineon(英飞凌); Supplier Footprint: LFBGA-292; JLCPCB Part Class: 扩展库; Datasheet: https://atta.szlcsc.com/upload/public/pdf/source/20230201/4817F3AB8052933065390DBFE5F4B895.pdf; Supplier: LCSC
X1 = X322520MSB4SI: 晶振类型:贴片晶振;频率:20MHz;常温频差:±10ppm;外接负载电容:20pF;频率稳定度(全温):±20ppm;; LCSC Part Name: 20MHz ±10ppm 20pF; Supplier Part: C9004; Manufacturer: YXC(扬兴晶振); Supplier Footprint: SMD3225-4P; JLCPCB Part Class: 扩展库; Datasheet: https://atta.szlcsc.com/upload/public/pdf/source/20240329/19D5F850207469550BEB00D7DFEDBC7A.pdf; Supplier: LCSC; Crystal Type: 贴片晶振; Normal temperature Frequency Tolerance: ±10ppm; External load capacitor: 20pF; Frequency Stability(Full temperature range): ±20ppm; Operating Temperature: -40℃~+85℃
CN2 CN3 = HX15001-6AWB: 插针结构:1x6P;间距:1.5mm;安装方式:卧贴;参考系列:-;总PIN数:6P;排数:1;每排PIN数:6;行距:-;额定电流:1A;工作温度范围:-25℃~+85℃;; LCSC Part Name: 1x6P 间距:1.5mm 卧贴; Supplier Part: C442153; Manufacturer: HX(红星); Supplier Footprint: SMD,P=1.5mm,卧贴; JLCPCB Part Class: 扩展库; Datasheet: https://atta.szlcsc.com/upload/public/pdf/source/20200415/C442142_C06F0DDFBB95EC3947D2DC5802394DE5.pdf; Supplier: LCSC; Pins Structure: 1x6P; Pitch: 1.5mm; Mounting Style: 卧贴; Number of Pins: 6P; Number of Rows: 1; Number of PINs Per Row: 6; Current Rating (Max): 1A; Operating Temperature Range: -25℃~+85℃
FPC1 = FPC-05F-18PH20: 锁定特性:翻盖式;触点类型:下接;触点数量:18P;间距:0.5mm;安装类型:卧贴;工作温度范围:-25℃~+85℃;; LCSC Part Name: 间距:0.5mm P数:18P 翻盖式 下接; Supplier Part: C2856802; Manufacturer: XUNPU(讯普); Supplier Footprint: SMD,P=0.5mm,卧贴; JLCPCB Part Class: 扩展库; Datasheet: https://atta.szlcsc.com/upload/public/pdf/source/20210922/C2856802_2A845D1961F33AEC1ED22CECB292335F.pdf; Supplier: LCSC; Locking Feature: 翻盖式; Contact Type: 下接; Number of Contacts: 18P; Pitch: 0.5mm; Mounting Type: 卧贴; FFC, FCB Thickness: 0.3mm; Height Above Board: 2mm; Operating Temperature Range: -25℃~+85℃
H2-H5 = PZ254V-11-03P: 插针结构:1x3P;间距:2.54mm;行距:-;圆针/方针:方针;安装类型:直插;排数:单排;总PIN位数:3P;额定电流:3A;额定电压:250V;配合针长度:6mm;塑高:2.5mm;端接针长度:3mm;工作温度范围:-40℃~+105℃;颜色:黑色;; LCSC Part Name: 间距:2.54mm 1x3P 直插 方针; Supplier Part: C2937625; Manufacturer: XFCN(兴飞); Supplier Footprint: 插件,P=2.54mm; JLCPCB Part Class: 扩展库; Datasheet: https://atta.szlcsc.com/upload/public/pdf/source/20200309/C492402_8335C3D49C4E4C618838D59BB1D024C1.pdf; Supplier: LCSC; Pin Structure: 1x3P; Pitch: 2.54mm; Circluar Pins/Square Pins: 方针; Mounting Type: 直插; Number of Rows: 单排; Number of Pins: 3P; Current Rating (Max): 3A; Voltage Rating (Max): 250V; Length of Mating Pin: 6mm; Insulation Height: 2.5mm; Length of End Connection Pin: 3mm; Operating Temperature Range: -40℃~+105℃; Color: 黑色
P1 = 2.54-1*8P母环保: 插孔结构:1x8P;间距:2.54mm;行距:-;安装类型:直插;排数:单排;总孔位数:8P;塑高:-;触头材质:-;触头镀层:-;; LCSC Part Name: 间距:2.54mm 1x8P 直插; Supplier Part: C27438; Manufacturer: BOOMELE(博穆精密); Supplier Footprint: 插件,P=2.54mm; JLCPCB Part Class: 扩展库; Datasheet: https://atta.szlcsc.com/upload/public/pdf/source/20231221/1CA800C6799ED97958773716FAA1BFFE.pdf; Supplier: LCSC; Holes Structure: 1x8P; Pitch: 2.54mm; Mounting Type: 直插; Number of Rows: 单排; Number of Holes: 8P
R10 R12 R13 R23-R25 = RC0603FR-074K7L: 阻值:4.7kΩ;精度:±1%;功率:100mW;温度系数:±100ppm/℃;最大工作电压:75V;工作温度范围:-55℃~+155℃;; LCSC Part Name: 4.7kΩ ±1% 100mW; Supplier Part: C99782; Manufacturer: YAGEO(国巨); Supplier Footprint: 0603; JLCPCB Part Class: Extended Part; Datasheet: https://atta.szlcsc.com/upload/public/pdf/source/20171030/C99782_15093665213961068236.pdf; Supplier: LCSC; Tolerance: ±1%; Power(Watts): 100mW; Temperature Coefficient: ±100ppm/℃; Overload Voltage (Max): 75V; Operating Temperature Range: -55℃~+155℃
SW3 = DSWB02LHGET: 类型:平拨,凸起式;电路结构:单刀单掷;开关位数:2位;使用寿命:-;颜色:红色;; LCSC Part Name: 拨码开关,平拨开关,DSWB02LHGET; Supplier Part: C99421; Manufacturer: YE; Supplier Footprint: 插件; JLCPCB Part Class: 扩展库; Datasheet: https://atta.szlcsc.com/upload/public/pdf/source/20230906/EFD9230F686161BBBCD1B62855702D44.pdf; Supplier: LCSC; Type: 平拨,凸起式; Circuit: 单刀单掷; Number of Positions: 2位; Lead Pitch: 2.54mm; Color: 红色
SW4 = TM-4175-B-A: 多功能开关 7.5*7.5*5 五向开关 H5; LCSC Part Name: 多功能开关 7.5*7.5*5 五向开关 H5; Supplier Part: C465995; Manufacturer: XKB Connection(中国星坤); Supplier Footprint: SMD-8P,7.5x7.5mm; JLCPCB Part Class: 扩展库; Datasheet: https://atta.szlcsc.com/upload/public/pdf/source/20211011/A0F6117F2AB0E02F6CF3847B7456F266.pdf; Supplier: LCSC
U6 = ICM-42688-P: 传感器类型:加速度计陀螺仪;; Supplier Part: C1850418; Manufacturer: TDK InvenSense(应美盛); Supplier Footprint: LGA-14(2.5x3); JLCPCB Part Class: 扩展库; Datasheet: https://atta.szlcsc.com/upload/public/pdf/source/20210703/CF24204867ACE5B754A2B035F23E5931.pdf; Supplier: LCSC; Sensor Type: 加速度计陀螺仪
U7 = 2541FV-2x3P: 插孔结构:2x3P;间距:2.54mm;圆孔/方孔:方孔;安装类型:直插;排数:双排;总孔位数:6P;额定电流:3A;额定电压:250V;插孔方向:顶部;工作温度范围:-40℃~+105℃;; LCSC Part Name: 间距:2.54mm 2x3P 直插; Supplier Part: C18723054; Manufacturer: HanElectricity(瀚源); Supplier Footprint: 插件,P=2.54mm; JLCPCB Part Class: 扩展库; Datasheet: https://atta.szlcsc.com/upload/public/pdf/source/20231018/348A30CBB18FAA04E40F2CE12A6EAA75.pdf; Supplier: LCSC; Holes Structure: 2x3P; Pitch: 2.54mm; Circular Hole / Square Hole: 方孔; Mounting Type: 直插; Number of Rows: 双排; Number of Holes: 6P; Current Rating (Max): 3A; Voltage Rating (Max): 250V; Holes Direction: 顶部; Operating Temperature Range: -40℃~+105℃
C45 = HV1H227M1010PZ: 容值:220uF;精度:±20%;额定电压:50V;; LCSC Part Name: 220uF ±20% 50V; Supplier Part: C5246564; Manufacturer: HONOR(荣誉); Supplier Footprint: SMD,D10xL10mm; JLCPCB Part Class: 扩展库; Datasheet: https://atta.szlcsc.com/upload/public/pdf/source/20221103/F889AFCC379E96C645A0A58E4BAC43B0.pdf; Supplier: LCSC; Tolerance: ±20%; Rated Voltage: 50V; φD: 10mm; L: 10mm; Operating Temperature: -55℃~+105℃
CN1 = XT60PW-M: 类别:-;类型1:-;; LCSC Part Name: AMASS(艾迈斯)航模插头xt60连接器150公母对接pw锂电池公头 板插卧式XT60PW-M; Supplier Part: C98732; Manufacturer: AMASS(艾迈斯); JLCPCB Part Class: 扩展库; Datasheet: https://atta.szlcsc.com/upload/public/pdf/source/20240118/44A3DCFF53BE25DC65378AFFB21277A4.pdf; Supplier: LCSC; Brand: 艾迈斯; Type: 卧式插头; Colour: 黄色; InterfaceType: 公头
D1 = BZT52C16_C173426: 二极管配置:独立式;稳压值(标称值):16V;稳压值(范围):15.3V~17.1V;精度:-;功率:500mW;反向电流(Ir):100nA@11.2V;阻抗(Zzt):40Ω;; LCSC Part Name: 16V 500mW; Supplier Part: C173426; Manufacturer: MDD; Supplier Footprint: SOD-123; JLCPCB Part Class: Extended Part; Datasheet: https://atta.szlcsc.com/upload/public/pdf/source/20180207/C173426_15179895458921356272.pdf; Supplier: LCSC; Diode Configuration: 独立式; Zener Voltage (Nom): 16V; Zener Voltage (Range): 15.3V~17.1V; Power Dissipation: 500mW; Reverse Leakage Current (Ir): 100nA@11.2V; Zener Impedance (Zzt): 40Ω
D2 = SMDJ15CA_C224065: 极性:双向;反向截止电压(Vrwm):15V;最大钳位电压:24.4V;峰值脉冲电流(Ipp):123A;峰值脉冲功率(Ppp):3kW;击穿电压:16.7V;; Supplier Part: C224065; Manufacturer: Littelfuse(美国力特); Supplier Footprint: DO-214AB; JLCPCB Part Class: 扩展库; Datasheet: https://atta.szlcsc.com/upload/public/pdf/source/20190531/C224064_5E2465AA5B1C10D8D3FDAF2BCD0A9891.pdf; Supplier: LCSC; polarity: 双向; Reverse Stand-Off Voltage (Vrwm): 15V; Maximum Clamping Voltage: 24.4V; Peak Pulse Current (Ipp): 123A; Peak Pulse Power Dissipation (Ppp): 3kW; Breakdown Voltage: 16.7V; Type: TVS
Q2 = HY19P03D: 导通电阻(RDS(on)@Vgs,Id):6mΩ 45A,10V;阈值电压(Vgs(th)@Id):3V 250μA;漏源电压(Vdss):30V;功率(Pd):50W;类型:P沟道;连续漏极电流(Id):90A;; Supplier Part: C122492; Manufacturer: HUAYI(华羿微); Supplier Footprint: TO-252-2L; JLCPCB Part Class: Extended Part; Datasheet: https://atta.szlcsc.com/upload/public/pdf/source/20170728/C122492_1501225751911848809.pdf; Supplier: LCSC; Drain Source On Resistance (RDS(on)@Vgs,Id): 6mΩ 45A,10V; Gate Threshold Voltage (Vgs(th)@Id): 3V 250μA; Drain Source Voltage (Vdss): 30V; Power Dissipation (Pd): 50W; Type: P沟道; Continuous Drain Current (Id): 90A
R14 R17 = 0402WGF1002TCE: 电阻类型:厚膜电阻;阻值:10kΩ;精度:±1%;功率:62.5mW;最大工作电压:50V;温度系数:±100ppm/℃;; LCSC Part Name: 10kΩ ±1% 62.5mW 厚膜电阻; Supplier Part: C25744; Manufacturer: UNI-ROYAL(厚声); Supplier Footprint: 0402; JLCPCB Part Class: 基础库; Datasheet: https://atta.szlcsc.com/upload/public/pdf/source/20200306/C422600_1E6D84923E4A46A82E41ADD87F860B5C.pdf; Supplier: LCSC; Type: 厚膜电阻; Tolerance: ±1%; Power(Watts): 62.5mW; Overload Voltage (Max): 50V; Temperature Coefficient: ±100ppm/℃; Operating Temperature Range: -55℃~+155℃
R21 R22 = 0603WAF3003T5E: 电阻类型:厚膜电阻;阻值:300kΩ;精度:±1%;功率:100mW;最大工作电压:75V;温度系数:±100ppm/℃;; LCSC Part Name: 300kΩ ±1% 100mW 厚膜电阻; Supplier Part: C23024; Manufacturer: UNI-ROYAL(厚声); Supplier Footprint: 0603; JLCPCB Part Class: 基础库; Datasheet: https://atta.szlcsc.com/upload/public/pdf/source/20200306/C422600_1E6D84923E4A46A82E41ADD87F860B5C.pdf; Supplier: LCSC; Type: 厚膜电阻; Tolerance: ±1%; Power(Watts): 100mW; Overload Voltage (Max): 75V; Temperature Coefficient: ±100ppm/℃; Operating Temperature Range: -55℃~+155℃
SW2 = SK12D07VG5: 电路结构:单刀双掷;安装方式:侧插;开关颜色:-;额定电流(DC):500mA;额定电压(DC):50V;额定电流(AC):-;额定电压(AC):-;机械寿命:5千次;; LCSC Part Name: 两档位卧式拨动开关,柄长5MM; Supplier Part: C431548; Manufacturer: SHOU HAN(首韩); Supplier Footprint: 插件; JLCPCB Part Class: 扩展库; Datasheet: https://atta.szlcsc.com/upload/public/pdf/source/20190925/C431548_D6571AEBDE139FDB1E6F8A4B1513A630.pdf; Supplier: LCSC; Circuit: 单刀双掷; Pin Style: PC引脚; Switch Length: 8.7mm; Switch Width: 4.4mm; Switch Height: 4.7mm; Mounting Style: 侧插; Current Rating (DC): 500mA; Voltage Rating (DC): 50V; Mechanical Life: 5千次; Operating Temperature: -10℃~+50℃
U2 = TPS82130SILR: TPS82130 TPS82130 具有集成电感的 3A 17V 降压转换器; Supplier Part: C473914; Manufacturer: TI(德州仪器); Supplier Footprint: USIP-8; JLCPCB Part Class: 扩展库; Datasheet: https://www.ti.com/cn/lit/gpn/tps82130; Supplier: LCSC
U3 U4 = RT9013-33GB_C19268157: Supplier Part: C19268157; Manufacturer: TECH PUBLIC(台舟); Supplier Footprint: SOT-23-5; Datasheet: https://atta.szlcsc.com/upload/public/pdf/source/20231201/9D78CA17020D67EC103F1AC7C29CF260.pdf; Supplier: LCSC
U5 = ETA7014S2G: Supplier Part: C7465500; Manufacturer: ETA(钰泰）; Supplier Footprint: SOT23-6; JLCPCB Part Class: 扩展库; Datasheet: https://atta.szlcsc.com/upload/public/pdf/source/20230717/2B472CB1BF6DFB47746E529AC2956F59.pdf; Supplier: LCSC
C65-C67 C69 C77-C79 C81 = CL21A475KAQNNNE: 容值:4.7uF;精度:±10%;额定电压:25V;材质(温度系数):X5R;; LCSC Part Name: 4.7uF ±10% 25V; Supplier Part: C1779; Manufacturer: SAMSUNG(三星); Supplier Footprint: 0805; JLCPCB Part Class: 基础库; Datasheet: https://atta.szlcsc.com/upload/public/pdf/source/20160218/1457707763339.pdf; Supplier: LCSC; Tolerance: ±10%; Voltage Rated: 25V; Temperature Coefficient: X5R
L7-L10 = SMMS0650-3R3M: 电感值:3.3uH;精度:±20%;额定电流:8.5A;饱和电流(Isat):9A;类型:一体成型电感;; LCSC Part Name: 3.3uH ±20% 9A; Supplier Part: C149581; Manufacturer: SXN(顺翔诺); Supplier Footprint: SMD,6.6x7.1mm; JLCPCB Part Class: 扩展库; Datasheet: https://atta.szlcsc.com/upload/public/pdf/source/20210810/BBF24330FB2F5029F637830BA9C42C0D.pdf; Supplier: LCSC; Tolerance: ±20%; Rated Current: 8.5A; Saturation Current (Isat): 9A; DC Resistance (DCR): 22mΩ; Type: 一体成型电感
U10-U13 = TPS54821RHLR: 功能类型:降压型;输出类型:固定;输入电压:4.5V~17V;输出电压:600mV~17V;输出电流:8A;; LCSC Part Name: 4.5V至17V输入、8A同步降压转换器; Supplier Part: C57461; Manufacturer: TI(德州仪器); Supplier Footprint: VQFN-14-EP(3.5x3.5); JLCPCB Part Class: 扩展库; Datasheet: https://www.ti.com/cn/lit/gpn/tps54821; Supplier: LCSC; Function: 降压型; Output Type: 固定; Input Voltage: 4.5V~17V; Output Voltage: 600mV~17V; Output Current: 8A; Switching Frequency: 200kHz~1.6MHz; Operating Temperature: -40℃~+125℃; Synchronous Rectification: 是; Number of Outputs: 1; Topology: 降压式; Quiescent Current (Iq): 2uA; Switch tube (built-in/external): 内置
Q3-Q8 = CSD87350Q5D: 类型:2个N沟道;漏源电压(Vdss):30V;连续漏极电流(Id):40A;导通电阻(RDS(on)@Vgs,Id):1.2mΩ@5V,25A;功率(Pd):12W;阈值电压(Vgs(th)@Id):1V@250uA;; LCSC Part Name: 2个N沟道 耐压:30V 电流:40A; Supplier Part: C140356; Manufacturer: TI(德州仪器); Supplier Footprint: LSON-8-EP(5x6); JLCPCB Part Class: 扩展库; Datasheet: https://www.ti.com/cn/lit/gpn/csd87350q5d; Supplier: LCSC; Type: 2个N沟道; Drain Source Voltage (Vdss): 30V; Continuous Drain Current (Id): 40A; Drain Source On Resistance (RDS(on)@Vgs,Id): 1.2mΩ@5V,25A; Power Dissipation (Pd): 12W; Gate Threshold Voltage (Vgs(th)@Id): 1V@250uA; Total Gate Charge (Qg@Vgs): 10.9nC@4.5V; Input Capacitance (Ciss@Vds): 1.77nF@15V; Reverse Transfer Capacitance (Crss@Vds): 25pF@15V; Operating Temperature: -55℃~+150℃
U8 U9 = DRV8323HRTAR: DRV8323 具有电流分流放大器的最大 65V 三相智能栅极驱动器; LCSC Part Name: 5mA 无刷直流BLDC电机驱动芯片 60V; Supplier Part: C701783; Manufacturer: TI(德州仪器); Supplier Footprint: QFN-40-EP(6x6); JLCPCB Part Class: 扩展库; Datasheet: https://www.ti.com/cn/lit/gpn/drv8323; Supplier: LCSC

## Nets
3V3CAM: C41.2 C42.2 FPC1.17 FPC1.18 R13.1 U4.5(VOUT)
3V3CORE: C1.1 C2.1 C3.1 C4.1 C5.1 C6.1 C7.1 C8.1 C9.1 C10.1 C17.2 C32.2 C33.2 H1.1 L2.2 Q1.2(S2) R7.1 RN1.7 RN1.8 RN2.5 RN2.6 RN2.7 RN2.8 U1.5(OUT) U14.A2(VEXT) U14.A19(VDDP3) U14.B3(VEXT) U14.B18(VDDP3) U14.D5(VFLEX) U14.N20(VEXT) U14.T11(VEVRSB) U14.V19(VEXT) U14.W20(VEXT)
DVDD1: C59.2 R26.1 R28.2 R30.2 R34.2 U8.33(DVDD)
DVDD2: C60.2 R27.1 R29.2 R31.2 R35.2 U9.33(DVDD)
GND: C11.1 C34.2 C35.1 C36.1 C39.1 C40.1 C43.1 C44.1 C45.2 C46.1 C47.1 C48.1 C49.2 C50.1 C51.1 C52.1 C57.1 C58.1 C61.2 C62.2 C65.2 C66.2 C67.1 C68.2 C69.1 C70.2 C71.1 C72.1 C73.1 C74.1 C77.2 C78.2 C79.1 C80.2 C81.1 C82.2 C83.1 C84.1 C85.1 C86.1 CN1.1(-) CN2.1 CN3.1 D2.1 H2.3 H3.3 H4.3 H5.3 L4.1 L5.1 L6.1 LED2.1(K) LED3.1(K) LED5.1(K) LED6.1(K) LED9.1(K) LED10.1(K) LED11.1(K) LED12.1(K) P1.1 Q3.9(GND) Q4.9(GND) Q5.9(GND) Q6.9(GND) Q7.9(GND) Q8.9(GND) R9.2 R16.1 R20.1 R22.1 R32.2 R33.2 R36.2 R37.2 R38.1 R39.1 R45.1 R47.1 R48.1 R49.1 R55.1 R57.1 SW1.2 SW3.3 SW3.4 SW4.5(COM) U2.3(GND) U2.9(EP) U3.2(GND) U5.6(GND) U6.2(RESV) U6.3(RESV) U6.6(GND) U6.7(RESV) U6.10(RESV) U6.11(RESV) U7.5 U7.6 U8.9(SPA) U8.10(SNA) U8.11(SNB) U8.12(SPB) U8.19(SPC) U8.20(SNC) U8.26(MODE) U8.29(GAIN) U8.31(CAL) U8.40(PGND) U8.41(EP) U9.9(SPA) U9.10(SNA) U9.11(SNB) U9.12(SPB) U9.19(SPC) U9.20(SNC) U9.26(MODE) U9.29(GAIN) U9.31(CAL) U9.40(PGND) U9.41(EP) U10.2(GND) U10.3(GND) U10.15(EP) U11.2(GND) U11.3(GND) U11.15(EP) U12.2(GND) U12.3(GND) U12.15(EP) U13.2(GND) U13.3(GND) U13.15(EP)
GNDCAM: C37.1 C38.1 C41.1 C42.1 FPC1.2 FPC1.7 FPC1.16 L6.2 LED4.1(K) U4.2(GND)
GNDCORE: C1.2 C2.2 C3.2 C4.2 C5.2 C6.2 C7.2 C8.2 C9.2 C10.2 C12.2 C13.2 C14.2 C15.2 C16.2 C17.1 C18.1 C19.2 C20.2 C21.1 C22.2 C23.2 C24.2 C25.2 C26.1 C30.1 C31.1 C32.1 C33.1 H1.3 H1.5 L3.2 L4.2 L5.2 LED1.1(K) Q1.5(S1) RN1.5 RN1.6 U1.2(GND) U14.A20(VSS) U14.B2(VSS) U14.B19(VSS) U14.D4(VSS) U14.D17(VSS) U14.E5(VSS) U14.E16(VSS) U14.G9(VSS) U14.G10(VSS) U14.G11(VSS) U14.G12(VSS) U14.H9(VSS) U14.H10(VSS) U14.H11(VSS) U14.H12(VSS) U14.J7(VSS) U14.J8(VSS) U14.J10(VSS) U14.J11(VSS) U14.J13(VSS) U14.J14(VSS) U14.K7(VSS) U14.K8(VSS) U14.K9(VSS) U14.K10(VSS) U14.K11(VSS) U14.K12(VSS) U14.K13(VSS) U14.L7(VSS) U14.L8(VSS) U14.L9(VSS) U14.L10(VSS) U14.L11(VSS) U14.L12(VSS) U14.L13(VSS) U14.L14(VSS) U14.L20(VSS) U14.M7(VSS) U14.M8(VSS) U14.M10(VSS) U14.M11(VSS) U14.M13(VSS) U14.M14(VSS) U14.N9(VSS) U14.N10(VSS) U14.N11(VSS) U14.N12(VSS) U14.P9(VSS) U14.P10(VSS) U14.P11(VSS) U14.P12(VSS) U14.T16(VSS) U14.U17(VSS) U14.W19(VSS) U14.Y20(VSS)
VBAT: C45.1 C47.2 C55.1 C56.1 C57.2 C58.2 C65.1 C66.1 C67.2 C69.2 C77.1 C78.1 C79.2 C81.2 D2.2 Q2.2(D) Q3.1(VIN) Q3.2(VIN) Q4.1(VIN) Q4.2(VIN) Q5.1(VIN) Q5.2(VIN) Q6.1(VIN) Q6.2(VIN) Q7.1(VIN) Q7.2(VIN) Q8.1(VIN) Q8.2(VIN) R14.2 R15.2 R18.1 R19.1 R21.2 U5.4(IN) U8.4(VM) U8.5(VDRAIN) U9.4(VM) U9.5(VDRAIN) U10.4(PVIN) U10.5(PVIN) U10.6(VIN) U11.4(PVIN) U11.5(PVIN) U11.6(VIN) U12.4(PVIN) U12.5(PVIN) U12.6(VIN) U13.4(PVIN) U13.5(PVIN) U13.6(VIN)
VCC1V3: C12.1 C13.1 C14.1 C15.1 C16.1 C18.2 C19.1 C20.1 C22.1 C23.1 C24.1 C25.1 L1.2 U14.D16(VDD) U14.E15(VDD) U14.G8(VDD) U14.G13(VDD) U14.H7(VDD) U14.H14(VDD) U14.N7(VDD) U14.N14(VDD) U14.N19(VDD) U14.P8(VDD) U14.P13(VDD)
VCC3V3: C39.2 C40.2 C50.2 C51.2 C52.2 P1.2 R1.2 R12.1 R23.2 R24.1 R25.1 RN3.5 RN3.6 RN3.7 RN3.8 U3.5(VOUT) U6.5(VDDIO) U6.8(VDD) U7.4
VCC5V: C30.2 C31.2 C35.2 C36.2 C37.2 C38.2 C44.2 C61.1 C62.1 CN2.6 CN3.6 R8.2 R10.1 R11.2 U1.1(IN) U1.3(EN) U2.4(VOUT) U2.5(VOUT) U3.1(VIN) U3.3(CE) U4.1(VIN) U4.3(CE) U7.2 U8.24(VREF) U8.30(ENABLE) U9.24(VREF) U9.30(ENABLE)
VCC12V: C43.2 C46.2 R17.2 U2.1(EN) U2.2(VIN) U5.3(VOUT)
VCCSERA: H2.2 L7.2 R40.2 R41.2
VCCSERB: H3.2 L8.2 R42.2 R43.2
VCCSERC: H4.2 L9.2 R50.2 R51.2
VCCSERD: H5.2 L10.2 R52.2 R53.2
VDDM: C27.1 L2.1 R3.2 R4.2 U14.Y5(VDDM)
VSSM: C27.2 L3.1 R5.2 R6.2 U14.Y4(VSSM)
AN0: U14.T10(AN0)
AN1: U14.U10(AN1)
AN2: U14.W9(AN2)
AN3: U14.U9(AN3)
AN4: U14.T9(AN4)
AN5: C49.1 R21.1 R22.2 U14.Y9(AN5)
AN6: U14.T8(AN6)
AN7: U14.U8(AN7)
AN8: U14.W8(AN8)
AN9: U14.U7(AN9)
AN10: U14.Y8(AN10)
AN11: U14.W7(AN11)
AN12: U14.T7(AN12)
AN13: U14.W6(AN13)
AN14: U14.U6(AN14)
AN15: U14.T6(AN15)
AN16: U14.W5(AN16)
AN17: U14.U5(AN17/P40.10)
AN18: U14.W4(AN18/P40.11)
AN19: U14.W3(AN19/P40.12)
AN20: U14.Y3(AN20)
AN21: U14.Y2(AN21)
AN22: U14.T5(AN22)
AN23: U14.R5(AN23)
AN24: U14.W2(AN24/P40.0)
AN25: U14.W1(AN25/P40.1)
AN26: U14.V2(AN26/P40.2)
AN27: U14.V1(AN27/P40.3)
AN28: U14.U2(AN28/P40.13)
AN29: U14.U1(AN29/P40.14)
AN30: U14.T4(AN30)
AN31: U14.R4(AN31)
AN32: U14.P4(AN32/P40.4)
AN33: U14.R1(AN33/P40.5)
AN34: U14.P5(AN34)
AN35: U14.R2(AN35)
AN36: U14.N4(AN36/P40.6)
AN37: U14.P2(AN37/P40.7)
AN38: U14.N5(AN38/P40.8)
AN39: U14.P1(AN39/P40.9)
AN40: U14.M5(AN40)
AN41: U14.M4(AN41)
AN42: U14.L5(AN42)
AN43: U14.L4(AN43)
AN44: U14.N1(AN44)
AN45: U14.N2(AN45)
AN46: U14.M1(AN46)
AN47: U14.M2(AN47)
CSA: CN2.2 U14.Y13(P33.7)
CSB: CN3.2 U14.A10(P11.2)
ESR0#: U14.F16(ESR0#)
ESR1#: U14.G16(ESR1#)
GHA: Q3.3(TG) U8.6(GHA)
GHB: Q6.3(TG) U8.15(GHB)
GHC: Q8.3(TG) U8.16(GHC)
GHX: Q4.3(TG) U9.6(GHA)
GHY: Q7.3(TG) U9.15(GHB)
GHZ: Q5.3(TG) U9.16(GHC)
GLA: Q3.5(BG) U8.8(GLA)
GLB: Q6.5(BG) U8.13(GLB)
GLC: Q8.5(BG) U8.18(GLC)
GLX: Q4.5(BG) U9.8(GLA)
GLY: Q7.5(BG) U9.13(GLB)
GLZ: Q5.5(BG) U9.18(GLC)
HCRX: U7.3 U14.Y14(P33.9)
HCTX: U7.1 U14.W14(P33.8)
ICM_CS: U6.12(AP_CS) U14.D20(P20.13)
ICM_MISO: U6.1(AP_SDO/AP_AD0) U14.D19(P20.12)
ICM_MOSI: U6.14(AP_SDA/AP_SDIO/AP_SDI) U14.C20(P20.14)
ICM_SCL: U6.13(AP_SCL/AP_SCLK) U14.E20(P20.11)
IDRIVE1: R34.1 R36.1 U8.27(IDRIVE)
IDRIVE2: R35.1 R37.1 U9.27(IDRIVE)
MISOA: CN2.3 U14.Y16(P33.13)
MISOB: CN3.3 U14.B10(P11.3)
MOSIA: CN2.4
MOSIB: CN3.4
NFAULT1: LED8.1(K) R26.2 U8.25(nFAULT)
NFAULT2: LED7.1(K) R27.2 U9.25(nFAULT)
P00.0: FPC1.8 U14.G1(P00.0)
P00.1: FPC1.9 U14.G2(P00.1)
P00.2: FPC1.10 U14.H1(P00.2)
P00.3: FPC1.11 U14.H2(P00.3)
P00.4: FPC1.12 U14.J1(P00.4)
P00.5: FPC1.13 U14.J2(P00.5)
P00.6: FPC1.14 U14.J4(P00.6)
P00.7: FPC1.15 U14.K1(P00.7)
P00.8: U14.K4(P00.8)
P00.9: U14.K2(P00.9)
P00.10: U14.K5(P00.10)
P00.11: U14.L1(P00.11)
P00.12: H2.1 U14.L2(P00.12)
P01.3: U14.G5(P01.3)
P01.4: U14.G4(P01.4)
P01.5: U14.H5(P01.5)
P01.6: U14.H4(P01.6)
P01.7: U14.J5(P01.7)
P02.0: FPC1.6 U14.B1(P02.0)
P02.1: FPC1.1 U14.C2(P02.1)
P02.2: FPC1.4 U14.C1(P02.2)
P02.3: FPC1.3 U14.D2(P02.3)
P02.4: U14.D1(P02.4)
P02.5: U14.E2(P02.5)
P02.6: U14.E1(P02.6)
P02.7: U14.F2(P02.7)
P02.8: U14.F1(P02.8)
P02.9: U14.E4(P02.9)
P02.10: U14.F5(P02.10)
P02.11: U14.F4(P02.11)
P10.0: U9.38(INHC) U14.A7(P10.0)
P10.1: U14.B7(P10.1)
P10.2: U9.36(INHB) U14.A5(P10.2)
P10.3: U9.37(INLB) U14.A6(P10.3)
P10.4: U14.B6(P10.4)
P10.5: RN2.2 U14.B5(P10.5)
P10.6: RN2.1 U14.A4(P10.6)
P10.7: U14.A3(P10.7)
P10.8: U9.39(INLC) U14.B4(P10.8)
P11.0: U14.E10(P11.0)
P11.1: U14.E9(P11.1)
P11.4: U14.D10(P11.4)
P11.5: U14.D8(P11.5)
P11.6: CN3.5 U14.D9(P11.6)
P11.7: U14.E8(P11.7)
P11.8: U14.E7(P11.8)
P11.9: U14.A9(P11.9)
P11.10: H5.1 U14.B9(P11.10)
P11.11: H4.1 U14.A8(P11.11)
P11.12: U14.B8(P11.12)
P11.13: U14.E6(P11.13)
P11.14: U14.D7(P11.14)
P11.15: U14.D6(P11.15)
P12.0: U14.E12(P12.0)
P12.1: U14.E11(P12.1)
P13.0: U14.B12(P13.0)
P13.1: U14.A12(P13.1)
P13.2: U14.B11(P13.2)
P13.3: U14.A11(P13.3)
P14.0: H1.7 U14.B16(P14.0)
P14.1: H1.9 U14.A15(P14.1)
P14.2: RN2.3 U14.E13(P14.2)
P14.3: RN1.2 U14.B14(P14.3)
P14.4: RN1.4 U14.B15(P14.4)
P14.5: RN1.3 U14.A14(P14.5)
P14.6: RN1.1 U14.B13(P14.6)
P14.7: U9.34(INHA) U14.D13(P14.7)
P14.8: R23.1 SW4.6(D) U14.A13(P14.8)
P14.9: U14.D12(P14.9)
P14.10: U14.D11(P14.10)
P15.0: P1.6 U14.B20(P15.0)
P15.1: P1.5 U14.A18(P15.1)
P15.2: P1.7 U14.C19(P15.2)
P15.3: P1.3 U14.B17(P15.3)
P15.4: P1.8 U14.A17(P15.4)
P15.5: P1.4 U14.E14(P15.5)
P15.6: RN3.1 SW4.3(C) U14.A16(P15.6)
P15.7: U14.D15(P15.7)
P15.8: U9.35(INLA) U14.D14(P15.8)
P20.0: RN3.4 SW4.4(B) U14.H20(P20.0)
P20.1: U14.G19(P20.1)
P20.2: RN2.4 U14.H19(P20.2)
P20.3: RN3.3 SW4.1(A) U14.G20(P20.3)
P20.6: U14.F17(P20.6)
P20.7: U14.F19(P20.7)
P20.8: RN3.2 SW4.2(CEN) U14.F20(P20.8)
P20.9: U14.E17(P20.9)
P20.10: U14.E19(P20.10)
P21.0: U14.K17(P21.0)
P21.1: U14.J17(P21.1)
P21.2: U14.K19(P21.2)
P21.3: U14.J19(P21.3)
P21.4: R25.2 SW3.1 U14.K20(P21.4)
P21.5: R24.2 SW3.2 U14.J20(P21.5)
P21.6: U14.H17(P21.6/TDI)
P21.7: H1.6 U14.H16(P21.7/TDO)
P22.0: U8.35(INLA) U14.P20(P22.0)
P22.1: U8.34(INHA) U14.P19(P22.1)
P22.2: U8.37(INLB) U14.R20(P22.2)
P22.3: U8.36(INHB) U14.R19(P22.3)
P22.4: U14.P16(P22.4)
P22.5: U14.P17(P22.5)
P22.6: U14.N16(P22.6)
P22.7: U14.N17(P22.7)
P22.8: U14.M16(P22.8)
P22.9: U14.M17(P22.9)
P22.10: U14.L16(P22.10)
P22.11: U14.L17(P22.11)
P23.0: U14.V20(P23.0)
P23.1: U8.39(INLC) U14.U19(P23.1)
P23.2: U14.U20(P23.2)
P23.3: U14.T19(P23.3)
P23.4: U14.T20(P23.4)
P23.5: U14.T17(P23.5)
P23.6: U14.R17(P23.6)
P23.7: U14.R16(P23.7)
P32.2: U14.Y18(P32.2)
P32.3: U14.Y19(P32.3)
P32.4: U8.38(INHC) U14.W18(P32.4)
P32.5: U14.T15(P32.5)
P32.6: U14.U15(P32.6)
P32.7: U14.U16(P32.7)
P33.0: U14.W10(P33.0)
P33.1: U14.Y10(P33.1)
P33.2: U14.W11(P33.2)
P33.3: U14.Y11(P33.3)
P33.4: H3.1 U14.W12(P33.4)
P33.5: U14.Y12(P33.5)
P33.6: U14.W13(P33.6)
P33.10: U14.W15(P33.10)
P33.11: CN2.5 U14.Y15(P33.11)
P33.12: U14.W16(P33.12)
P33.14: U14.T14(P33.14)
P33.15: U14.U14(P33.15)
P34.1: U14.U11(P34.1)
P34.2: U14.T12(P34.2)
P34.3: U14.U12(P34.3)
P34.4: U14.T13(P34.4)
P34.5: U14.U13(P34.5)
PG: R11.1 U2.7(PG)
RST: H1.10 R2.1 U14.G17(PORST#)
SHA: Q3.4(TGR) Q3.6(VSW) Q3.7(VSW) Q3.8(VSW) U8.7(SHA)
SHB: Q6.4(TGR) Q6.6(VSW) Q6.7(VSW) Q6.8(VSW) U8.14(SHB)
SHC: Q8.4(TGR) Q8.6(VSW) Q8.7(VSW) Q8.8(VSW) U8.17(SHC)
SHX: Q4.4(TGR) Q4.6(VSW) Q4.7(VSW) Q4.8(VSW) U9.7(SHA)
SHY: Q7.4(TGR) Q7.6(VSW) Q7.7(VSW) Q7.8(VSW) U9.14(SHB)
SHZ: Q5.4(TGR) Q5.6(VSW) Q5.7(VSW) Q5.8(VSW) U9.17(SHC)
TCK: H1.4 U14.J16(TCK)
TMS: H1.2 U14.K16(TMS)
TRST: H1.8 U14.L19(TRST#)
VAGND1: C28.2 R5.1 U14.Y7(VAGND1)
VAGND2: C29.2 R6.1 U14.T2(VAGND2)
VAREF1: C28.1 R3.1 U14.Y6(VAREF1)
VAREF2: C29.1 R4.1 U14.T1(VAREF2)
VDS1: R30.1 R32.1 U8.28(VDS)
VDS2: R31.1 R33.1 U9.28(VDS)
VGATE1N: Q1.1(G1) U14.Y17(P32.0/VGATE1N)
VGATE1P: Q1.3(G2) U14.W17(P32.1/VGATE1P)
VSEA: R40.1 R45.2 U10.7(VSENSE)
VSEB: R42.1 R47.2 U11.7(VSENSE)
VSEC: R50.1 R55.2 U12.7(VSENSE)
VSED: R52.1 R57.2 U13.7(VSENSE)
$1N5868: LED1.2(A) R7.2
$1N21074: C11.2 R1.1 R2.2 SW1.1
$1N22345: L1.1 Q1.4(D2) Q1.6(D1)
$2N1087: D1.2(A) R20.2 SW2.3
$2N1088: CN1.2(+) D1.1(K) Q2.3(S) SW2.1
$2N1092: Q2.1(G) SW2.2
$2N3737: C48.2 R19.2 U5.5(VCC)
$2N5107: R15.1 R16.2 U5.1(FB)
$2N5228: R18.2 U5.2(EN)
$2N5353: LED3.2(A) R12.2
$2N5428: LED4.2(A) R13.2
$2N30786: R8.1 R9.1 U2.6(FB)
$2N30791: C34.1 U2.8(SS/TR)
$2N32992: LED6.2(A) R17.1
$2N33117: LED5.2(A) R14.1
$2N41809: LED2.2(A) R10.2
$4N29086: LED8.2(A) R28.1
$4N29088: LED7.2(A) R29.1
$5N28613: C73.2 R44.1
$5N29282: C74.2 R46.1
$5N29939: C85.2 R54.1
$5N30596: C86.2 R56.1
$5N34622: LED9.2(A) R41.1
$5N34624: LED10.2(A) R43.1
$5N34626: LED12.2(A) R53.1
$5N34628: LED11.2(A) R51.1
Net-(C21-2): C21.2 U14.M20(XTAL1) X1.3(OSC2)
Net-(C26-2): C26.2 U14.M19(XTAL2) X1.1(OSC1)
Net-(C53-1): C53.1 U8.2(CPH)
Net-(C53-2): C53.2 U8.1(CPL)
Net-(C54-1): C54.1 U9.2(CPH)
Net-(C54-2): C54.2 U9.1(CPL)
Net-(C55-2): C55.2 U8.3(VCP)
Net-(C56-2): C56.2 U9.3(VCP)
Net-(C59-1): C59.1 U8.32(AGND)
Net-(C60-1): C60.1 U9.32(AGND)
Net-(C63-1): C63.1 U10.13(BOOT)
Net-(C63-2): C63.2 L7.1 U10.11(PH) U10.12(PH)
Net-(C64-1): C64.1 U11.13(BOOT)
Net-(C64-2): C64.2 L8.1 U11.11(PH) U11.12(PH)
Net-(C68-1): C68.1 U10.9(SS/TR)
Net-(C70-1): C70.1 U11.9(SS/TR)
Net-(C71-2): C71.2 R44.2 U10.8(COMP)
Net-(C72-2): C72.2 R46.2 U11.8(COMP)
Net-(C75-1): C75.1 U12.13(BOOT)
Net-(C75-2): C75.2 L9.1 U12.11(PH) U12.12(PH)
Net-(C76-1): C76.1 U13.13(BOOT)
Net-(C76-2): C76.2 L10.1 U13.11(PH) U13.12(PH)
Net-(C80-1): C80.1 U12.9(SS/TR)
Net-(C82-1): C82.1 U13.9(SS/TR)
Net-(C83-2): C83.2 R54.2 U12.8(COMP)
Net-(C84-2): C84.2 R56.2 U13.8(COMP)
Net-(R38-2): R38.2 U10.1(RT/CLK)
Net-(R39-2): R39.2 U11.1(RT/CLK)
Net-(R48-2): R48.2 U12.1(RT/CLK)
Net-(R49-2): R49.2 U13.1(RT/CLK)

Not connected (* = marked no-connect by the designer): CN1 3* 4*; CN2 7* 8*; CN3 7* 8*; FPC1 5* 19* 20*; SW2 4* 5*; SW4 7(EH)*; U1 4(NC)*; U3 4(NC)*; U4 4(NC)*; U6 4(INT1/INT)* 9(INT2/FSYNC/CLKIN)*; U8 21(SOC)* 22(SOB)* 23(SOA)*; U9 21(SOC)* 22(SOB)* 23(SOA)*; U10 10(EN)* 14(PWRGD)*; U11 10(EN)* 14(PWRGD)*; U12 10(EN)* 14(PWRGD)*; U13 10(EN)* 14(PWRGD)*; U14 A1(NC1)* K14(NC)* U4(NC1)* Y1(NC1)*; X1 2(GND)* 4(GND)*

## Notes on the sheets
sheet 1
- Standby Core Power
- External Power
- Digital Gnd
- Flex Power
- Flash Power
- Reset
- 1.3V Power
- Digital Core Power
- TC377
- 下载口
- Analog Power
- MCU电源
- BOOT引脚
sheet 2
- 5V
- 3V3
- 3V3CAM
- TVS
- 开关
- 过压保护
- 电压检测
sheet 3
- 磁编码器
- 拨码开关
- 多向开关
- SPI4
- SPI1
- 注：若使用逐飞编码器则需要自行分配miso引脚
- SPI2
- 屏幕接口
- SPI0
- ICM-42688P
- A C:ATOM2
- UART2
- B D:ATOM3
- HC15
- 舵机接口
- 无刷输出
- 固定孔
- 摄像头
sheet 4
- 报错LED
- 报错LED
- 上拉默认不焊
- 上拉默认不焊
- 下拉默认不焊
- 下拉默认不焊
- ATOM0
- ATOM1
- DRV8323HR
- MOSFET
sheet 5
- 接470uf
- 接470uf
- 接470uf
- 接470uf
